# EAGLE board DiscoRap_V11 (EAGLE 6.6.0), part 1 of 2
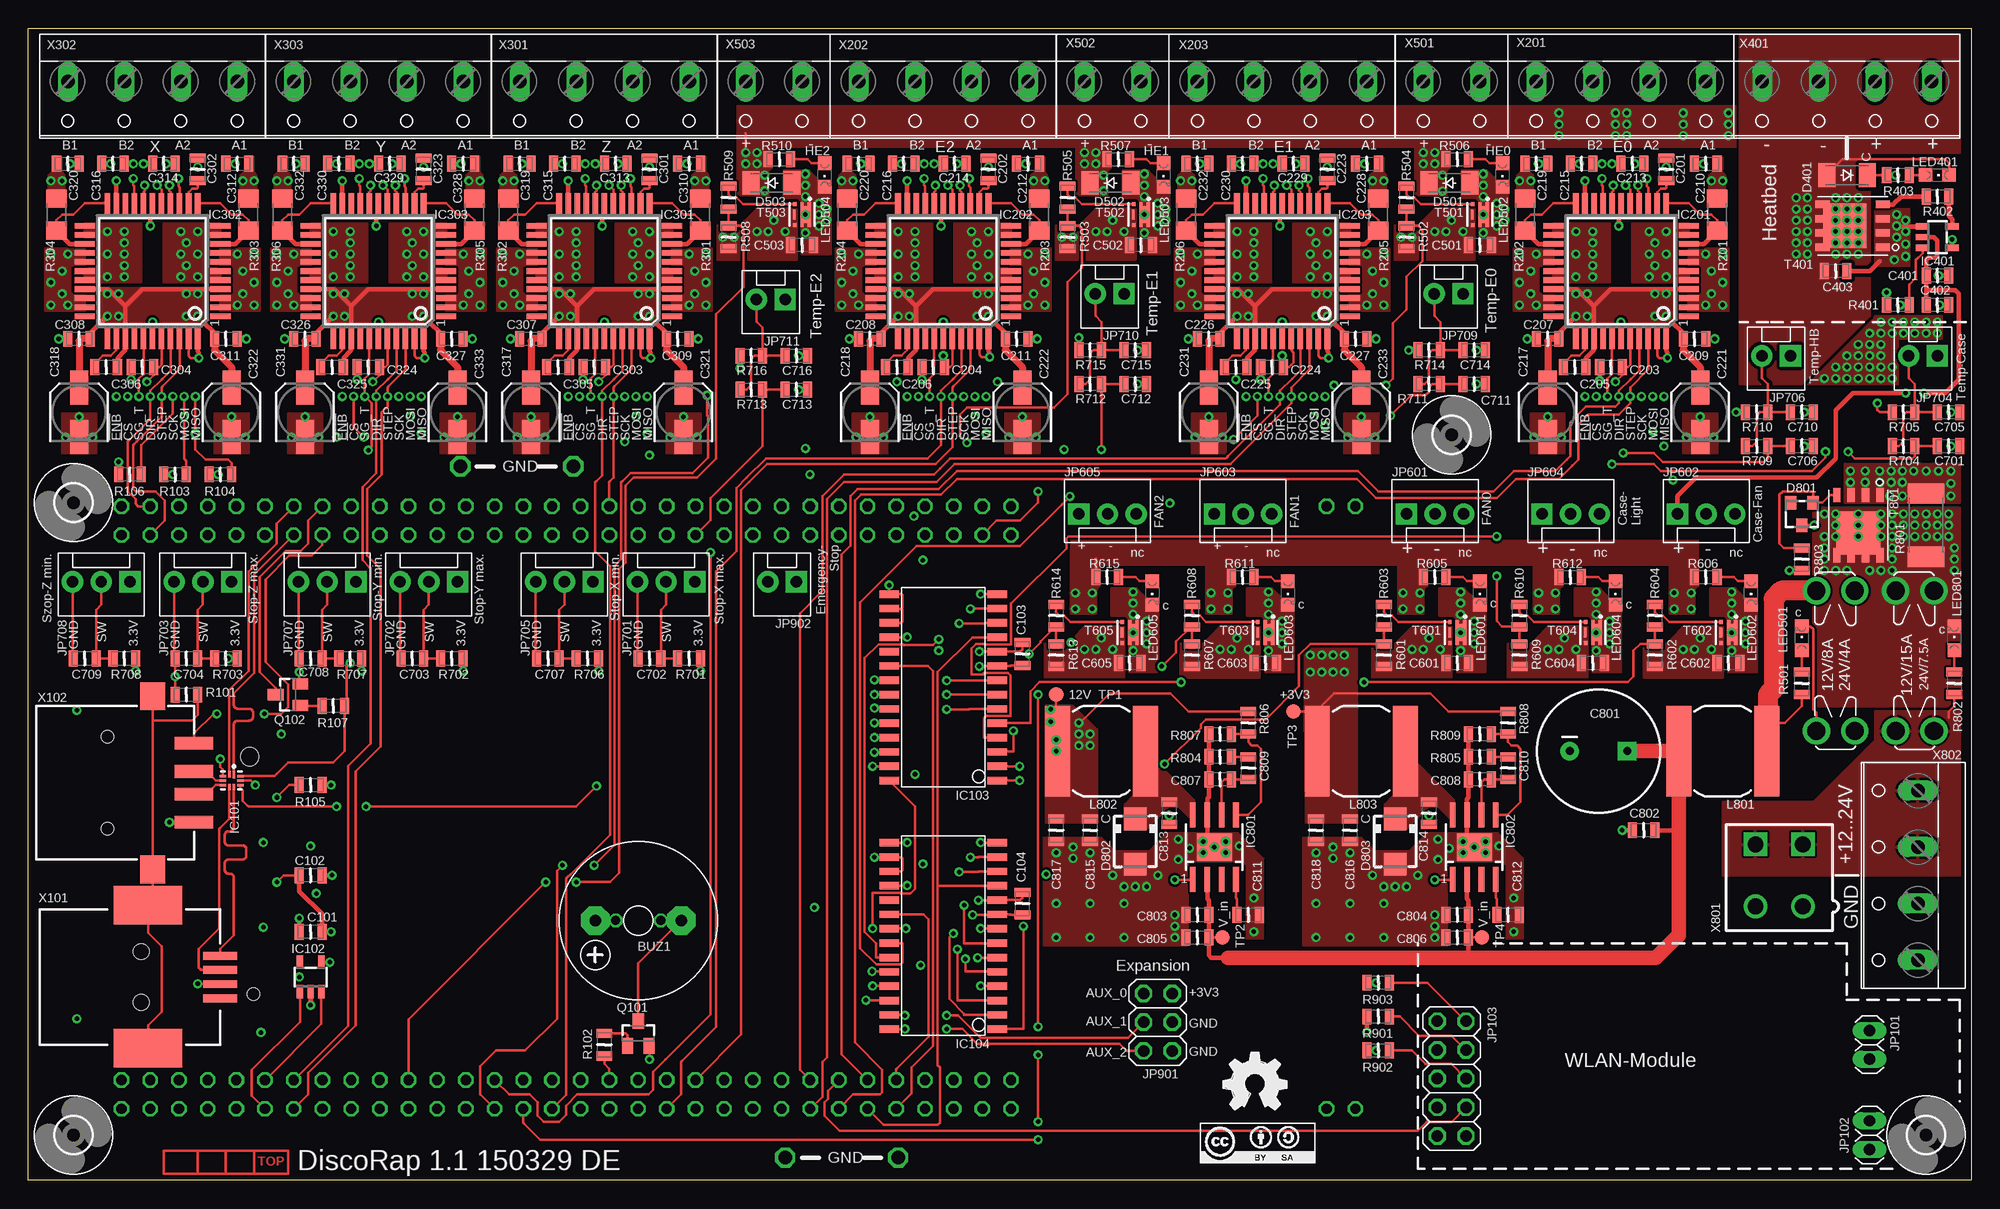
[diagram p9: board, top side]
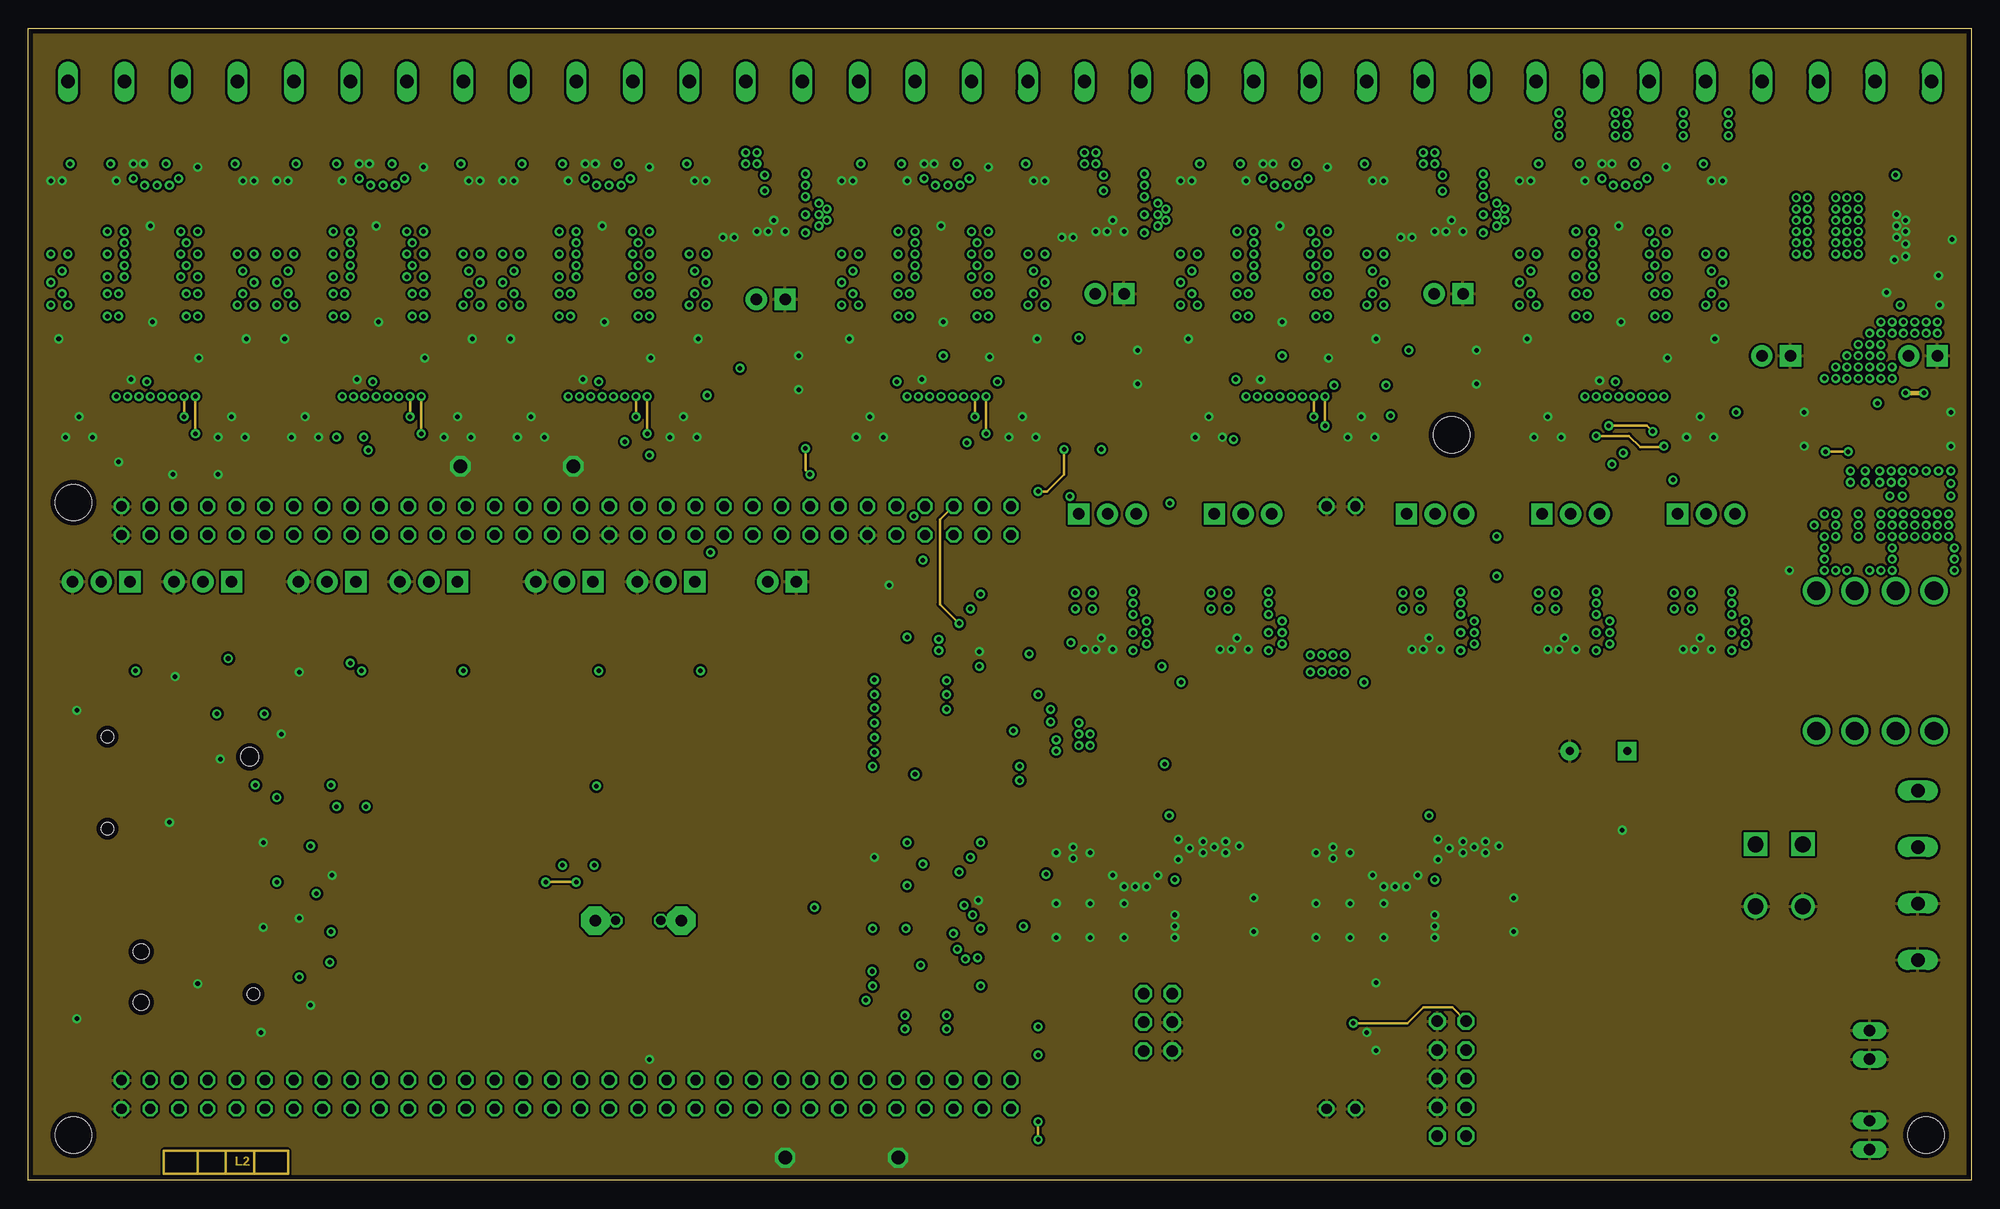
[diagram p10: board, inner layer Route2]
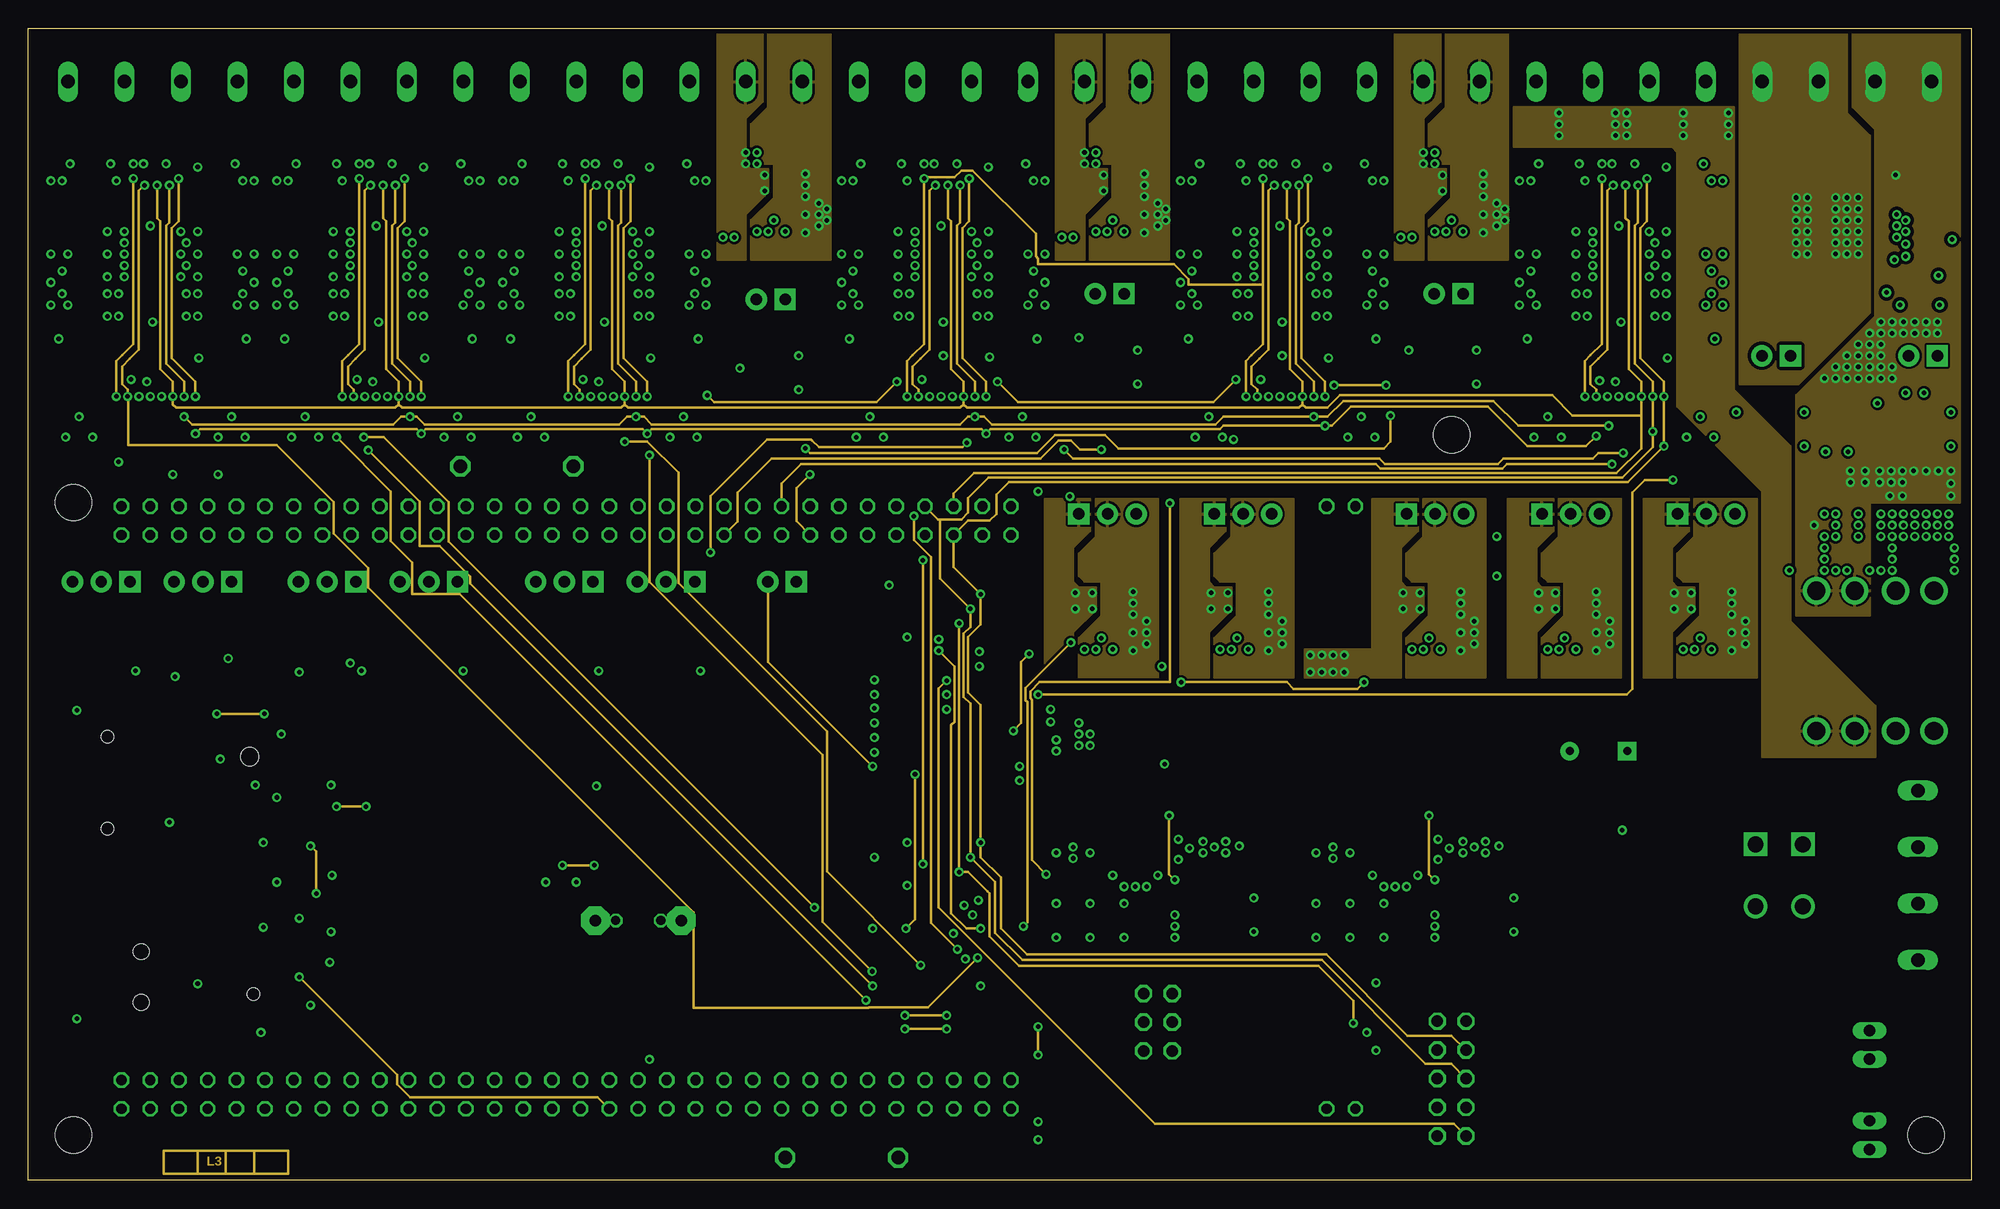
[diagram p11: board, inner layer Route15]
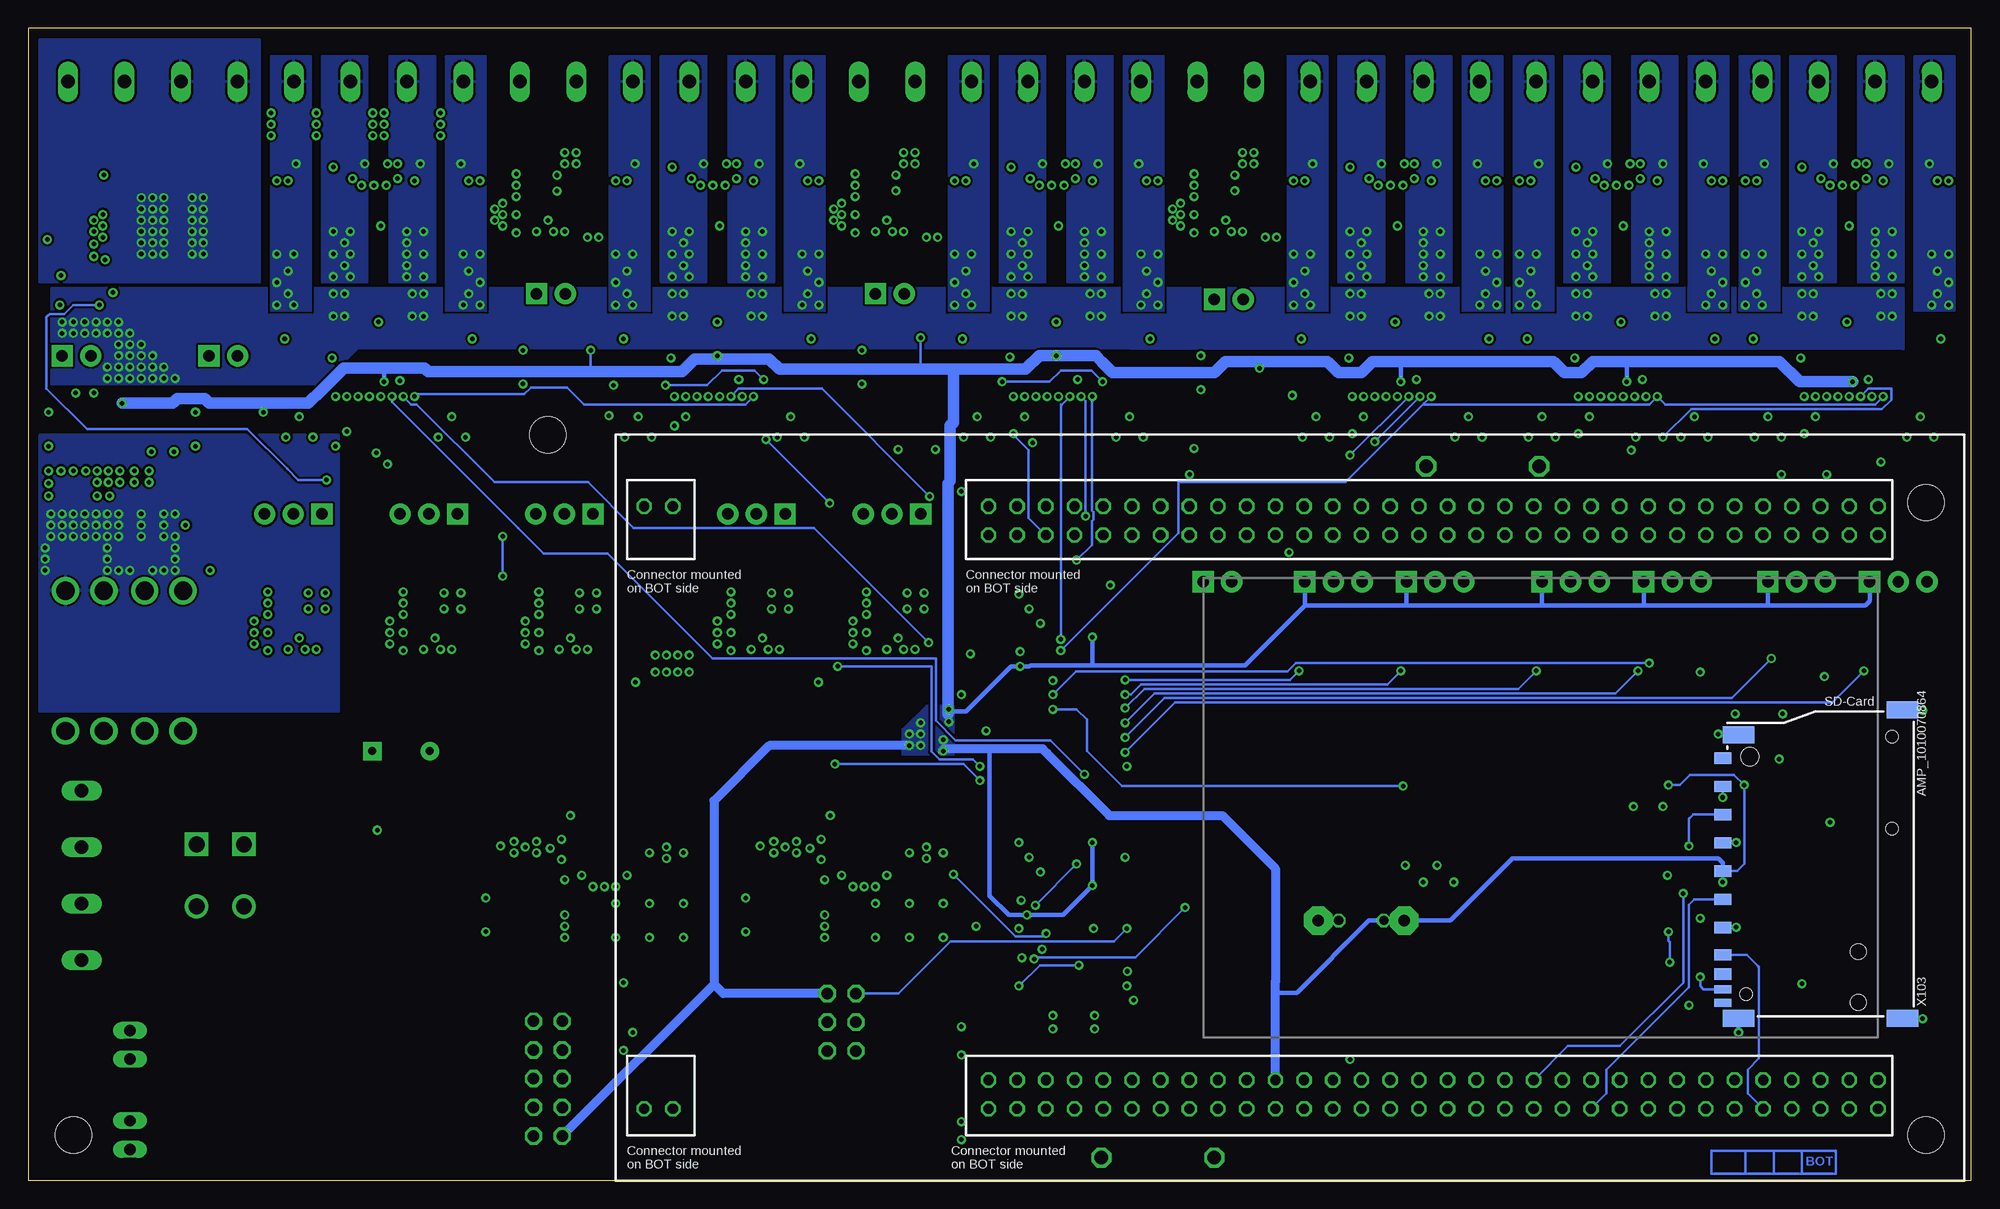
[diagram p12: board, bottom side, seen from below]

Size 172 x 102 mm. Coordinates in mm from the lower left corner, seen from the top.
Outline: 0,0 0,102 172,102 172,0 0,0
Copper layers (1+(2*15)+16): Top 0.035mm / dielectric 0.2mm / Route2 0.035mm / dielectric 1mm / Route15 0.035mm / dielectric 0.2mm / Bottom 0.035mm
Design rules "Multi_PCB_Rules *": minimum track width 0.2mm, minimum drill 0.4mm, track to track 0.2mm, track to pad 0.2mm, pad to pad 0.2mm, via to via 0.2mm, smd to smd 0mil, copper to edge 0.4mm, drill to drill 0.2mm, minimum pad ring 0.2mm, minimum via ring 0.2mm, stop-mask expansion 0mil, vias tented up to drill 0.5mm, thermal gap 0.2mm

## Footprints (pad centres in the part's own frame; a part is rotated, then mirrored left to right if it is on the bottom)
F/CM12P = drill 1.016 pad 2.54 octagon: + 3.81,0; - -3.81,0
0805 = smd 0.8 x 1.4: 1 -1,0; 2 1,0
SANYO-OSCON_SMD_B6 = smd 3 x 1.6: + 2.2,0; - -2.2,0
CPOL-RADIAL-1000UF-25V = drill 0.7 pad 1.651 square: 1 2.54,0 | drill 0.7 pad 1.651: 2 -2.54,0
SOD-123_MINI-SMA = smd 1.5 x 2.1: A 1.8,0; C -1.8,0
TO236 = smd 1 x 1.2: A -1,-1; C 0,1; NC 1,-1
SMA = smd 2 x 2: A 2,0; C -2,0
3557 = drill 1.6: 1 -6.2,1.7; 2 -6.2,-1.7; 3 6.2,-1.7; 4 6.2,1.7
3,2 = hole 3.2: 0,0
MINI_QFN_10L = smd 0.663 x 0.225: 1 -0.52,0.2 | smd 0.563 x 0.225: 2 -0.57,-0.2; 6 0.57,-0.2; 7 0.57,0.2 | smd 0.225 x 0.563: 3 -0.4,-0.77; 4 0,-0.77; 5 0.4,-0.77; 8 0.4,0.77; 9 0,0.77; 10 -0.4,0.77
SOT23-5L = smd 0.55 x 1.2: 1 -0.95,-1.3; 2 0,-1.3; 3 0.95,-1.3; 4 0.95,1.3; 5 -0.95,1.3
SO28W = smd 0.65 x 1.7: 1 -7.62,-4.78; 2 -6.35,-4.78; 3 -5.08,-4.78; 4 -3.81,-4.78; 5 -2.54,-4.78; 6 -1.27,-4.78; 7 0,-4.78; 8 1.27,-4.78; 9 2.54,-4.78; 10 3.81,-4.78; 11 5.08,-4.78; 12 6.35,-4.78; 13 7.62,-4.78; 14 8.89,-4.78; 15 8.89,4.78; 16 7.62,4.78; 17 6.35,4.78; 18 5.08,4.78; 19 3.81,4.78; 20 2.54,4.78; 21 1.27,4.78; 22 0,4.78; 23 -1.27,4.78; 24 -2.54,4.78; 25 -3.81,4.78; 26 -5.08,4.78; 27 -6.35,4.78; 28 -7.62,4.78
SQFP-S-10X10-44 = smd 0.5 x 1.8: 1 -4,-6; 2 -3.2,-6; 3 -2.4,-6; 4 -1.6,-6; 5 -0.8,-6; 6 0,-6; 7 0.8,-6; 8 1.6,-6; 9 2.4,-6; 10 3.2,-6; 11 4,-6; 23 4,6; 24 3.2,6; 25 2.4,6; 26 1.6,6; 27 0.8,6; 28 0,6; 29 -0.8,6; 30 -1.6,6; 31 -2.4,6; 32 -3.2,6; 33 -4,6 | smd 1.8 x 0.5: 12 6,-4; 13 6,-3.2; 14 6,-2.4; 15 6,-1.6; 16 6,-0.8; 17 6,0; 18 6,0.8; 19 6,1.6; 20 6,2.4; 21 6,3.2; 22 6,4; 34 -6,4; 35 -6,3.2; 36 -6,2.4; 37 -6,1.6; 38 -6,0.8; 39 -6,0; 40 -6,-0.8; 41 -6,-1.6; 42 -6,-2.4; 43 -6,-3.2; 44 -6,-4
PDSO-G8 = smd 0.5 x 2.2: 1 -1.905,-2.857; 2 -0.635,-2.857; 3 0.635,-2.857; 4 1.905,-2.857; 5 1.905,2.857; 6 0.635,2.857; 7 -0.635,2.857; 8 -1.905,2.857 | smd 3.1 x 2.4: 9 0,0
1X02 = drill 1.016 long: 1 -1.27,0; 2 1.27,0
2X05 = drill 1.016 octagon: 1 -5.08,-1.27; 2 -5.08,1.27; 3 -2.54,-1.27; 4 -2.54,1.27; 5 0,-1.27; 6 0,1.27; 7 2.54,-1.27; 8 2.54,1.27; 9 5.08,-1.27; 10 5.08,1.27
MOLEX-1X3 = drill 1.016 pad 1.88 square: 1 0,0 | drill 1.016 pad 1.88: 2 2.54,0; 3 5.08,0
MOLEX-1X2 = drill 1.016 pad 1.88 square: 1 0,0 | drill 1.016 pad 1.88: 2 2.54,0
2X03 = drill 1.016 octagon: 1 -2.54,-1.27; 2 -2.54,1.27; 3 0,-1.27; 4 0,1.27; 5 2.54,-1.27; 6 2.54,1.27
SRN8040 = smd 2.2 x 8: 1 -3.9,0; 2 3.9,0
CHIPLED_0805 = smd 1.2 x 1.2: A 0,-1.05; C 0,1.05
SOT23-BEC = smd 1 x 1.4: B -0.95,-1.1; C 0,1.1; E 0.95,-1.1
R1206 = smd 1.6 x 1.803: 1 -1.422,0; 2 1.422,0
R2512 = smd 1.8 x 3.2: 1 -2.8,0; 2 2.8,0
SO-8_POWERPACK = smd 1.27 x 0.66: 1 -2.667,1.905; 2 -2.667,0.635; 3 -2.667,-0.635; 4 -2.667,-1.905; 5 2.667,-1.905; 6 2.667,-0.635; 7 2.667,0.635; 8 2.667,1.905 | smd 3.81 x 3.912: EXP_PAD 0.686,0
SC70-6L = smd 0.3 x 0.35: 1 -0.65,-0.925; 2 0,-0.925; 3 0.65,-0.925; 4 0.65,0.925; 5 0,0.925; 6 -0.65,0.925 | smd 0.95 x 1.5: EXP_DRAIN -0.325,0 | smd 0.235 x 0.87: EXP_SOURCE 0.675,0
B1,27 = smd 1.27 x 1.27: TP 0,0
USB_B_SMD = smd 0.7 x 3: 1 1.875,0; 2 -0.625,0; 3 -1.875,0; 4 0.625,0 | smd 3.4 x 6.04: 5 6.3,-6.4; 6 -6.35,-6.4 | hole 1.4: -2.25,-7; 2.25,-7
TE_USB_A_SMD = smd 1.12 x 3.39: 1 -3.5,7.68; 2 -1,7.68; 3 1,7.68; 4 3.5,7.68 | smd 2.44 x 2.22: 5 -7.67,4; 6 7.67,4 | hole 1.1: -4.06,0; 4.06,0
AMP_1010070864 = smd 1 x 1.5: 1 6.88,0; 2 4.38,0; 3 1.88,0; 4 -0.62,0; 5 -3.12,0; 6 -5.62,0; 7 -8.04,0; 8 -9.74,0; 9 9.38,0 | smd 0.7 x 1.5: DET -11.08,0; WP -12.28,0 | smd 1.5 x 2.8: GND1 -13.65,-1.4; GND2 11.45,-1.4; GND3 -13.65,-15.9; GND4 13.65,-15.9 | hole 1.1: -11.5,-2.05 | hole 1.6: 9.5,-2.4
STM429_DISCOVERY = drill 0.9 octagon: 1 -26.67,30.48; 1A -26.67,0; 1B 24.13,0; 2 26.67,30.48; 2A -24.13,0; 2B 26.67,0; 3 -26.67,27.94; 3A -26.67,-2.54; 3B 24.13,-2.54; 4 26.67,27.94; 4A -24.13,-2.54; 4B 26.67,-2.54; 5A -26.67,-5.08; 5B 24.13,-5.08; 6A -24.13,-5.08; 6B 26.67,-5.08; 7A -26.67,-7.62; 7B 24.13,-7.62; 8A -24.13,-7.62; 8B 26.67,-7.62; 9A -26.67,-10.16; 9B 24.13,-10.16; 10A -24.13,-10.16; 10B 26.67,-10.16; 11A -26.67,-12.7; 11B 24.13,-12.7; 12A -24.13,-12.7; 12B 26.67,-12.7; 13A -26.67,-15.24; 13B 24.13,-15.24; 14A -24.13,-15.24; 14B 26.67,-15.24; 15A -26.67,-17.78; 15B 24.13,-17.78; 16A -24.13,-17.78; 16B 26.67,-17.78; 17A -26.67,-20.32; 17B 24.13,-20.32; 18A -24.13,-20.32; 18B 26.67,-20.32; 19A -26.67,-22.86; 19B 24.13,-22.86; 20A -24.13,-22.86; 20B 26.67,-22.86; 21A -26.67,-25.4; 21B 24.13,-25.4; 22A -24.13,-25.4; 22B 26.67,-25.4; 23A -26.67,-27.94; 23B 24.13,-27.94; 24A -24.13,-27.94; 24B 26.67,-27.94; 25A -26.67,-30.48; 25B 24.13,-30.48; 26A -24.13,-30.48; 26B 26.67,-30.48; 27A -26.67,-33.02; 27B 24.13,-33.02; 28A -24.13,-33.02; 28B 26.67,-33.02; 29A -26.67,-35.56; 29B 24.13,-35.56; 30A -24.13,-35.56; 30B 26.67,-35.56; 31A -26.67,-38.1; 31B 24.13,-38.1; 32A -24.13,-38.1; 32B 26.67,-38.1; 33A -26.67,-40.64; 33B 24.13,-40.64; 34A -24.13,-40.64; 34B 26.67,-40.64; 35A -26.67,-43.18; 35B 24.13,-43.18; 36A -24.13,-43.18; 36B 26.67,-43.18; 37A -26.67,-45.72; 37B 24.13,-45.72; 38A -24.13,-45.72; 38B 26.67,-45.72; 39A -26.67,-48.26; 39B 24.13,-48.26; 40A -24.13,-48.26; 40B 26.67,-48.26; 41A -26.67,-50.8; 41B 24.13,-50.8; 42A -24.13,-50.8; 42B 26.67,-50.8; 43A -26.67,-53.34; 43B 24.13,-53.34; 44A -24.13,-53.34; 44B 26.67,-53.34; 45A -26.67,-55.88; 45B 24.13,-55.88; 46A -24.13,-55.88; 46B 26.67,-55.88; 47A -26.67,-58.42; 47B 24.13,-58.42; 48A -24.13,-58.42; 48B 26.67,-58.42; 49A -26.67,-60.96; 49B 24.13,-60.96; 50A -24.13,-60.96; 50B 26.67,-60.96; 51A -26.67,-63.5; 51B 24.13,-63.5; 52A -24.13,-63.5; 52B 26.67,-63.5; 53A -26.67,-66.04; 53B 24.13,-66.04; 54A -24.13,-66.04; 54B 26.67,-66.04; 55A -26.67,-68.58; 55B 24.13,-68.58; 56A -24.13,-68.58; 56B 26.67,-68.58; 57A -26.67,-71.12; 57B 24.13,-71.12; 58A -24.13,-71.12; 58B 26.67,-71.12; 59A -26.67,-73.66; 59B 24.13,-73.66; 60A -24.13,-73.66; 60B 26.67,-73.66; 61A -26.67,-76.2; 61B 24.13,-76.2; 62A -24.13,-76.2; 62B 26.67,-76.2; 63A -26.67,-78.74; 63B 24.13,-78.74; 64A -24.13,-78.74; 64B 26.67,-78.74
W237-4 = drill 1.194 long: 1 -7.5,-1.27; 2 -2.5,-1.27; 3 2.5,-1.27; 4 7.5,-1.27
W237-102 = drill 1.194 long: 1 -2.5,-1.27; 2 2.5,-1.27
MINIFITJR-4-VERTICAL = drill 1.4: 1 2.1,-2.75; 2 -2.1,-2.75 | drill 1.4 square: 3 2.1,2.75; 4 -2.1,2.75

## Placement (x,y rotation side)
BUZ1  F/CM12P  [F/CM12P]  54,23 180 top
C101  100nF  [0805]  25,22 180 top
C102  100nF  [0805]  25,27 0 top
C103  100nF  [0805]  88,46.6 90 top
C104  100nF  [0805]  88,24.5 90 top
C201  470nF/10V  [0805]  145,89.5 90 top
C202  470nF/10V  [0805]  85,89.5 90 top
C203  100nF/50V  [0805]  140.1,72 180 top
C204  100nF/50V  [0805]  80.1,72 180 top
C205  220nF/16V  [0805]  136.9,72 0 top
C206  220nF/16V  [0805]  76.9,72 0 top
C207  100nF/50V  [0805]  134.5,74.5 180 top
C208  100nF/50V  [0805]  74.5,74.5 180 top
C209  100nF/50V  [0805]  147.5,74.5 0 top
C210  100p/100V  [0805]  148.5,90 0 top
C211  100nF/50V  [0805]  87.5,74.5 0 top
C212  100p/100V  [0805]  88.5,90 0 top
C213  100p/100V  [0805]  142,90 180 top
C214  100p/100V  [0805]  82,90 180 top
C215  100p/100V  [0805]  137.5,90 0 top
C216  100p/100V  [0805]  77.5,90 0 top
C217  22µF/ low ESR  [SANYO-OSCON_SMD_B6]  134.5,68 90 top
C218  22µF/ low ESR  [SANYO-OSCON_SMD_B6]  74.5,68 90 top
C219  100p/100V  [0805]  133.5,90 180 top
C220  100p/100V  [0805]  73.5,90 180 top
C221  22µF/ low ESR  [SANYO-OSCON_SMD_B6]  148,68 90 top
C222  22µF/ low ESR  [SANYO-OSCON_SMD_B6]  88,68 90 top
C223  470nF/10V  [0805]  115,89.5 90 top
C224  100nF/50V  [0805]  110.1,72 180 top
C225  220nF/16V  [0805]  106.9,72 0 top
C226  100nF/50V  [0805]  104.5,74.5 180 top
C227  100nF/50V  [0805]  117.5,74.5 0 top
C228  100p/100V  [0805]  118.5,90 0 top
C229  100p/100V  [0805]  112,90 180 top
C230  100p/100V  [0805]  107.5,90 0 top
C231  22µF/ low ESR  [SANYO-OSCON_SMD_B6]  104.5,68 90 top
C232  100p/100V  [0805]  103.5,90 180 top
C233  22µF/ low ESR  [SANYO-OSCON_SMD_B6]  118,68 90 top
C301  470nF/10V  [0805]  55,89.5 90 top
C302  470nF/10V  [0805]  15,89.5 90 top
C303  100nF/50V  [0805]  50.1,72 180 top
C304  100nF/50V  [0805]  10.1,72 180 top
C305  220nF/16V  [0805]  46.9,72 0 top
C306  220nF/16V  [0805]  6.9,72 0 top
C307  100nF/50V  [0805]  44.5,74.5 180 top
C308  100nF/50V  [0805]  4.5,74.5 180 top
C309  100nF/50V  [0805]  57.5,74.5 0 top
C310  100p/100V  [0805]  58.5,90 0 top
C311  100nF/50V  [0805]  17.5,74.5 0 top
C312  100p/100V  [0805]  18.5,90 0 top
C313  100p/100V  [0805]  52,90 180 top
C314  100p/100V  [0805]  12,90 180 top
C315  100p/100V  [0805]  47.5,90 0 top
C316  100p/100V  [0805]  7.5,90 0 top
C317  22µF/ low ESR  [SANYO-OSCON_SMD_B6]  44.5,68 90 top
C318  22µF/ low ESR  [SANYO-OSCON_SMD_B6]  4.5,68 90 top
C319  100p/100V  [0805]  43.5,90 180 top
C320  100p/100V  [0805]  3.5,90 180 top
C321  22µF/ low ESR  [SANYO-OSCON_SMD_B6]  58,68 90 top
C322  22µF/ low ESR  [SANYO-OSCON_SMD_B6]  18,68 90 top
C323  470nF/10V  [0805]  35,89.5 90 top
C324  100nF/50V  [0805]  30.1,72 180 top
C325  220nF/16V  [0805]  26.9,72 0 top
C326  100nF/50V  [0805]  24.5,74.5 180 top
C327  100nF/50V  [0805]  37.5,74.5 0 top
C328  100p/100V  [0805]  38.5,90 0 top
C329  100p/100V  [0805]  32,90 180 top
C330  100p/100V  [0805]  27.5,90 0 top
C331  22µF/ low ESR  [SANYO-OSCON_SMD_B6]  24.5,68 90 top
C332  100p/100V  [0805]  23.5,90 180 top
C333  22µF/ low ESR  [SANYO-OSCON_SMD_B6]  38,68 90 top
C401  100nF  [0805]  169,80.1 0 top
C402  2u2  [0805]  169,77.5 0 top
C403  4n7  [0805]  160,80.5 0 top
C501  4n7  [0805]  128.5,82.8 180 top
C502  4n7  [0805]  98.5,82.8 180 top
C503  4n7  [0805]  68.5,82.8 180 top
C601  4n7  [0805]  126.5,45.8 180 top
C602  4n7  [0805]  150.5,45.8 180 top
C603  4n7  [0805]  109.5,45.8 180 top
C604  4n7  [0805]  138.5,45.8 180 top
C605  4n7  [0805]  97.5,45.8 180 top
C701  470nF  [0805]  170,65 0 top
C702  4n7  [0805]  55,46.2 180 top
C703  4n7  [0805]  34,46.2 180 top
C704  4n7  [0805]  14,46.2 180 top
C705  470nF  [0805]  170,68 0 top
C706  470nF  [0805]  157,65 0 top
C707  4n7  [0805]  46,46.2 180 top
C708  4n7  [0805]  25,46.2 180 top
C709  4n7  [0805]  5,46.2 180 top
C710  470nF  [0805]  157,68 0 top
C711  470nF  [0805]  128,70.5 0 top
C712  470nF  [0805]  98,70.5 0 top
C713  470nF  [0805]  68,70 0 top
C714  470nF  [0805]  128,73.5 0 top
C715  470nF  [0805]  98,73.5 0 top
C716  470nF  [0805]  68,73 0 top
C801  1000uF  [CPOL-RADIAL-1000UF-25V]  139,38 0 top
C802  2n7  [0805]  143,31 180 top
C803  4µ7 (08053D475MAT2A)  [0805]  103.5,23.5 180 top
C804  4µ7 (08053D475MAT2A)  [0805]  126.5,23.5 180 top
C805  4µ7 (08053D475MAT2A)  [0805]  103.5,21.5 180 top
C806  4µ7 (08053D475MAT2A)  [0805]  126.5,21.5 180 top
C807  330p  [0805]  105.5,35.5 180 top
C808  47p  [0805]  128.5,35.5 180 top
C809  10n  [0805]  108,36.5 90 top
C810  2n7  [0805]  131,36.5 90 top
C811  3n3  [0805]  108,23.5 0 top
C812  22n  [0805]  131,23.5 0 top
C813  100nF  [0805]  101,32.5 90 top
C814  100nF  [0805]  124,32.5 90 top
C815  10µ (08056D106KAT2A)  [0805]  94,31 270 top
C816  4µ7 (08053D475MAT2A)  [0805]  117,31 270 top
C817  10µ (08056D106KAT2A)  [0805]  91,31 270 top
C818  4µ7 (08053D475MAT2A)  [0805]  114,31 270 top
D401  CGRM4001-G  [SOD-123_MINI-SMA]  161,89 180 top
D501  CGRM4001-G  [SOD-123_MINI-SMA]  125.8,88.3 0 top
D502  CGRM4001-G  [SOD-123_MINI-SMA]  95.8,88.3 0 top
D503  CGRM4001-G  [SOD-123_MINI-SMA]  65.8,88.3 0 top
D801  BZX84C15SMD  [TO236]  157,59 180 top
D802  B240A-13-F  [SMA]  98,30 270 top
D803  B240A-13-F  [SMA]  121,30 270 top
F501  FUSE3557  [3557]  160,46 90 top
F801  FUSE3557  [3557]  167,46 90 top
H901  MOUNT-HOLE3.2  [3,2]  168,4 0 top
H902  MOUNT-HOLE3.2  [3,2]  4,60 0 top
H903  MOUNT-HOLE3.2  [3,2]  126,66 0 top
H904  MOUNT-HOLE3.2  [3,2]  4,4 0 top
IC101  DG2722  [MINI_QFN_10L]  18,35.4 270 top
IC102  24LC08BT-I/OT  [SOT23-5L]  25,18 0 top
IC103  MCP23S17SO  [SO28W]  81,43 90 top
IC104  MCP23S17SO  [SO28W]  81,21 90 top
IC201  TMC260  [SQFP-S-10X10-44]  141,80.5 90 top
IC202  TMC260  [SQFP-S-10X10-44]  81,80.5 90 top
IC203  TMC260  [SQFP-S-10X10-44]  111,80.5 90 top
IC301  TMC260  [SQFP-S-10X10-44]  51,80.5 90 top
IC302  TMC260  [SQFP-S-10X10-44]  11,80.5 90 top
IC303  TMC260  [SQFP-S-10X10-44]  31,80.5 90 top
IC401  MCP1402  [SOT23-5L]  169,83.5 270 top
IC801  TPS54332  [PDSO-G8]  105,29.5 0 top
IC802  TPS54332  [PDSO-G8]  128,29.5 0 top
JP101  [1X02]  163,12 270 top
JP102  [1X02]  163,4 270 top
JP103  [2X05]  126,9 270 top
JP601  [MOLEX-1X3]  122,59 0 top
JP602  [MOLEX-1X3]  146,59 0 top
JP603  [MOLEX-1X3]  105,59 0 top
JP604  [MOLEX-1X3]  134,59 0 top
JP605  [MOLEX-1X3]  93,59 0 top
JP701  [MOLEX-1X3]  59,53 180 top
JP702  [MOLEX-1X3]  38,53 180 top
JP703  [MOLEX-1X3]  18,53 180 top
JP704  [MOLEX-1X2]  169,73 180 top
JP705  [MOLEX-1X3]  50,53 180 top
JP706  [MOLEX-1X2]  156,73 180 top
JP707  [MOLEX-1X3]  29,53 180 top
JP708  [MOLEX-1X3]  9,53 180 top
JP709  [MOLEX-1X2]  127,78.5 180 top
JP710  [MOLEX-1X2]  97,78.5 180 top
JP711  [MOLEX-1X2]  67,78 180 top
JP901  [2X03]  100,14 270 top
JP902  [MOLEX-1X2]  68,53 180 top
L801  SRN8040-220M  [SRN8040]  150,38 180 top
L802  SRN8040-220M  [SRN8040]  95,38 180 top
L803  SRN8040-150M  [SRN8040]  118,38 180 top
LED401  [CHIPLED_0805]  169,89 270 top
LED501  [CHIPLED_0805]  157,48 0 top
LED502  [CHIPLED_0805]  130.5,89 180 top
LED503  [CHIPLED_0805]  100.5,89 180 top
LED504  [CHIPLED_0805]  70.5,89 180 top
LED601  [CHIPLED_0805]  128.5,52 180 top
LED602  [CHIPLED_0805]  152.5,52 180 top
LED603  [CHIPLED_0805]  111.5,52 180 top
LED604  [CHIPLED_0805]  140.5,52 180 top
LED605  [CHIPLED_0805]  99.5,52 180 top
LED801  [CHIPLED_0805]  170.5,48 0 top
LOGO1  OSHW_LOGO_FILLX0200-NT  [OSHW_FILLX200_NOTEXT]  105.75,6.25 0 top
Q101  BC817-25LT1SMD  [SOT23-BEC]  54,13 0 top
Q102  BC817-25LT1SMD  [SOT23-BEC]  23,43 90 top
R101  10k  [0805]  14,43 180 top
R102  10k  [0805]  51,12 270 top
R103  10k  [0805]  13,62.5 0 top
R104  10k  [0805]  17,62.5 0 top
R105  10k  [0805]  25,35 0 top
R106  10k  [0805]  9,62.5 0 top
R107  10k  [0805]  27,42 0 top
R201  0R15/0.5W  [R1206]  149.5,85.5 90 top
R202  0R15/0.5W  [R1206]  132.5,85.5 90 top
R203  0R15/0.5W  [R1206]  89.5,85.5 90 top
R204  0R15/0.5W  [R1206]  72.5,85.5 90 top
R205  0R15/0.5W  [R1206]  119.5,85.5 90 top
R206  0R15/0.5W  [R1206]  102.5,85.5 90 top
R301  0R15/0.5W  [R1206]  59.5,85.5 90 top
R302  0R15/0.5W  [R1206]  42.5,85.5 90 top
R303  0R15/0.5W  [R1206]  19.5,85.5 90 top
R304  0R15/0.5W  [R1206]  2.5,85.5 90 top
R305  0R15/0.5W  [R1206]  39.5,85.5 90 top
R306  0R15/0.5W  [R1206]  22.5,85.5 90 top
R401  100k  [0805]  165.5,77.5 180 top
R402  100  [0805]  169,87.1 180 top
R403  2k7  [0805]  165.5,89 0 top
R501  2k7  [0805]  157,44 90 top
R502  100k  [0805]  122,83.5 270 top
R503  100k  [0805]  92,83.5 270 top
R504  100  [0805]  122,87 90 top
R505  100  [0805]  92,87 90 top
R506  2k7  [0805]  126.5,90.4 0 top
R507  2k7  [0805]  96.5,90.4 0 top
R508  100k  [0805]  62,83.5 270 top
R509  100  [0805]  62,87 90 top
R510  2k7  [0805]  66.5,90.4 0 top
R601  100k  [0805]  120,46.5 270 top
R602  100k  [0805]  144,46.5 270 top
R603  100  [0805]  120,50 90 top
R604  100  [0805]  144,50 90 top
R605  2k7  [0805]  124.5,53.4 0 top
R606  2k7  [0805]  148.5,53.4 0 top
R607  100k  [0805]  103,46.5 270 top
R608  100  [0805]  103,50 90 top
R609  100k  [0805]  132,46.5 270 top
R610  100  [0805]  132,50 90 top
R611  2k7  [0805]  107.5,53.4 0 top
R612  2k7  [0805]  136.5,53.4 0 top
R613  100k  [0805]  91,46.5 270 top
R614  100  [0805]  91,50 90 top
R615  2k7  [0805]  95.5,53.4 0 top
R701  4k7  [0805]  58.5,46.2 180 top
R702  4k7  [0805]  37.5,46.2 180 top
R703  4k7  [0805]  17.5,46.2 180 top
R704  6k8  [0805]  166,65 180 top
R705  2k2  [0805]  166,68 180 top
R706  4k7  [0805]  49.5,46.2 180 top
R707  4k7  [0805]  28.5,46.2 180 top
R708  4k7  [0805]  8.5,46.2 180 top
R709  6k8  [0805]  153,65 180 top
R710  2k2  [0805]  153,68 180 top
R711  6k8  [0805]  124,70.5 180 top
R712  6k8  [0805]  94,70.5 180 top
R713  6k8  [0805]  64,70 180 top
R714  2k2  [0805]  124,73.5 180 top
R715  2k2  [0805]  94,73.5 180 top
R716  2k2  [0805]  64,73 180 top
R801  0R (n.c.)  [R2512]  168,58 90 top
R802  2k7  [0805]  170.5,44 90 top
R803  82k  [0805]  157,55 90 top
R804  4k87  [0805]  105.5,37.5 0 top
R805  20k  [0805]  128.5,37.5 0 top
R806  10k2 1%  [0805]  108,40.5 90 top
R807  3k24 1%  [0805]  105.5,39.5 0 top
R808  10k2 1%  [0805]  131,40.5 90 top
R809  820 1%  [0805]  128.5,39.5 0 top
R901  3k3  [0805]  119.5,14.5 0 top
R902  3k3  [0805]  119.5,11.5 0 top
R903  3k3  [0805]  119.5,17.5 0 top
T401  SIR416DP  [SO-8_POWERPACK]  161.5,84.5 180 top
T501  SIA400EDJ  [SC70-6L]  128.5,85.5 180 top
T502  SIA400EDJ  [SC70-6L]  98.5,85.5 180 top
T503  SIA400EDJ  [SC70-6L]  68.5,85.5 180 top
T601  SIA400EDJ  [SC70-6L]  126.5,48.5 180 top
T602  SIA400EDJ  [SC70-6L]  150.5,48.5 180 top
T603  SIA400EDJ  [SC70-6L]  109.5,48.5 180 top
T604  SIA400EDJ  [SC70-6L]  138.5,48.5 180 top
T605  SIA400EDJ  [SC70-6L]  97.5,48.5 180 top
T801  SI7145DP  [SO-8_POWERPACK]  162,58 270 top
TP1  TPB1,27  [B1,27]  91,43 270 top
TP2  TPB1,27  [B1,27]  105.7,21.5 90 top
TP3  TPB1,27  [B1,27]  112,41.5 270 top
TP4  TPB1,27  [B1,27]  128.7,21.5 90 top
U$3  CC-BY-SA  [CC-BY-SA]  109,3.75 0 top
X101  USB-B_SMD  [USB_B_SMD]  17,18 270 top
X102  TE_292303-9  [TE_USB_A_SMD]  7,35.2 270 top
X103  AMP_1010070864  [AMP_1010070864]  22,28 90 bottom
X104  STM32F429_DISCO  [STM429_DISCOVERY]  87,33 90 bottom
X201  [W237-4]  141,96 180 top
X202  [W237-4]  81,96 180 top
X203  [W237-4]  111,96 180 top
X301  [W237-4]  51,96 180 top
X302  [W237-4]  11,96 180 top
X303  [W237-4]  31,96 180 top
X401  [W237-4]  161,96 180 top
X501  [W237-102]  126,96 180 top
X502  [W237-102]  96,96 180 top
X503  [W237-102]  66,96 180 top
X801  ATX-4VERTICAL  [MINIFITJR-4-VERTICAL]  155,27 0 top
X802  [W237-4]  166,27 90 top

## Tracks (layer width: path | path; a pad name or v marks a point on that pad's centre or on a via)
!CS_PORTEX
  Top 0.2: IC103.11 83.58,48.08 80.5,45 80.5,43.5 80.5,26 | 80.5,26 80.5,10.2 80.7,10 80.7,5.1 80.5,4.9 75.73,4.9 X104.11A | IC104.11 80.58,26.08 80.5,26
!ENB_EXTRUDERS  (via drill 0.4)
  Top 0.2: IC201.19 139.4,88 139.3,88.1 v139.3,88.7 | IC203.19 109.4,88 109.3,88.1 v109.3,88.7 | IC202.19 79.4,88 79.3,88.1 v79.3,88.7 | v82.85,24.35 82.85,21 85.75,21 IC104.7
  Route15 0.2: v139.3,88.7 139.3,74.05 138.3,73.05 137.8,72.55 v137.8,69.4 | v109.3,88.7 109.3,79.3 | 109.3,79.3 109.3,74.05 108.3,73.05 107.8,72.55 v107.8,69.4 | v77.8,69.4 77.8,72.55 78.3,73.05 79.3,74.05 v79.3,88.7 79.35,88.75 79.35,88.8 82,88.8 82.6,89.4 83.6,89.4 89.2,83.8 89.2,81.8 89.4,81.6 89.4,81.1 101.4,81.1 102.7,79.8 102.7,79.3 109.25,79.3 109.3,79.3 | v79.2,54.9 v79.2,28
  Bottom 0.2: v107.8,69.4 108.5,68.7 122.8,68.7 124.3,70.2 127.5,70.2 128.1,69.6 137.6,69.6 v137.8,69.4 | v79.2,28 v82.85,24.35 | v79.2,54.9 77.85,56.25 77.85,58.35 77.7,58.5 77.7,59.15 77.85,59.3 77.85,69.4 v77.8,69.4
!SPI_EN_E0  (via drill 0.4)
  Top 0.2: IC201.18 140.2,87.5 140.3,87.6 v140.3,88.1 | v88.1,22.5 88.1,13.4 85.8,13.4 IC104.1
  Route15 0.2: v140.3,88.1 139.8,87.6 139.8,82.3 139.8,79.7 139.8,74.5 139.8,73.55 139,72.75 138.3,72.05 138.3,70.5 138.8,70 v138.8,69.4 | v88.1,22.5 88.45,22.85 88.45,42.35 88.3,42.5 88.3,43.6 v92.3,47.6
  Bottom 0.2: v92.3,47.6 102.45,57.75 118.4,57.75 122.45,61.8 130.7,61.8 137.6,68.7 138.1,68.7 v138.8,69.4
!SPI_EN_E1  (via drill 0.4)
  Top 0.2: IC203.18 110.2,87.5 110.3,87.6 v110.3,88.1 | v81.9,21.85 81.55,21.5 81.55,16.05 82.85,14.75 82.85,14.65 85.75,14.65 IC104.2 | v106.7,65.6 108.8,67.7 v108.8,69.4
  Route15 0.2: v110.3,88.1 109.8,87.6 109.8,82.3 109.8,79.7 109.8,74.5 109.8,73.55 109,72.75 108.3,72.05 108.3,70.5 108.8,70 v108.8,69.4 | v90.1,27.1 88.85,28.35 88.85,42.55 88.7,42.7 88.7,43.3 89.5,44.1 101.05,44.1 v101.05,59.95
  Bottom 0.2: v81.9,21.85 82.15,21.6 84.6,21.6 v90.1,27.1 | v106.7,65.6 v101.05,59.95
!SPI_EN_E2  (via drill 0.4)
  Top 0.2: IC202.18 80.2,87.5 80.3,87.6 v80.3,88.1 | v82.25,20.45 82.25,15.95 85.75,15.95 IC104.3
  Route15 0.2: v80.3,88.1 79.8,87.6 79.8,82.3 79.8,79.7 79.8,74.5 79.8,73.55 79,72.75 78.3,72.05 78.3,70.5 78.8,70 v78.8,69.4 | v82.25,20.45 79.9,22.8 79.9,55.2 78.4,56.7 v78.4,58.8
  Bottom 0.2: v78.4,58.8 78.4,69 v78.8,69.4
!SPI_EN_X  (via drill 0.4)
  Top 0.2: IC301.18 50.2,87.5 50.3,87.6 v50.3,88.1 | v84.3,17.2 85.75,17.2 IC104.4
  Route15 0.2: v50.3,88.1 49.8,87.6 49.8,82.3 49.8,79.7 49.8,74.5 49.8,73.55 49,72.75 48.3,72.05 48.3,70.5 48.8,70 v48.8,69.4 | v79,19.05 70.7,27.35 70.7,39.75 57.55,52.9 57.55,62.65 54.8,65.4 v52.8,65.4
  Bottom 0.2: v84.3,17.2 82.45,19.05 v79,19.05 | v48.8,69.4 v52.8,65.4
!SPI_EN_Y  (via drill 0.4)
  Top 0.2: IC303.18 30.2,87.5 30.3,87.6 v30.3,88.1 | v82.95,19.6 82.95,18.5 85.75,18.5 85.75,18.49 IC104.5 | v29.7,65.8 28.8,66.7 v28.8,69.4
  Route15 0.2: v30.3,88.1 29.8,87.6 29.8,82.3 29.8,79.7 29.8,74.5 29.8,73.55 29,72.75 28.3,72.05 28.3,70.5 28.8,70 v28.8,69.4 | v69.6,24.15 37.2,56.55 37.2,60.05 31.45,65.8 v29.7,65.8
  Bottom 0.2: v82.95,19.6 82.8,19.75 74,19.75 v69.6,24.15
!SPI_EN_Z  (via drill 0.4)
  Top 0.2: IC302.18 10.2,87.5 10.3,87.6 v10.3,88.1 | v84.05,19.7 85.75,19.7 IC104.6
  Route15 0.2: v10.3,88.1 9.8,87.6 9.8,82.3 9.8,79.7 9.8,74.5 9.8,73.55 9,72.75 8.3,72.05 8.3,70.5 8.8,70 v8.8,69.4 8.85,69.35 8.85,65.1 22,65.1 27.05,60.05 27.05,57.25 30.1,54.2 30.1,52.5 58.9,23.7 58.9,15.25 74.4,15.25 74.45,15.3 79.65,15.3 v84.05,19.7
!USB_OE  (via drill 0.4)
  Top 0.2: IC101.8 18.77,34.73 19,34.5 19,34.2 19,33.6 19.4,33.2 19.5,33.1 v27.3,33.1 | v29.9,33.1 48.5,33.1 v50.3,34.9 | IC103.6 83.33,41.73 83.3,41.7 v81.3,41.7
  Route15 0.2: v27.3,33.1 v29.9,33.1
  Bottom 0.2: v50.3,34.9 75.2,34.9 78.3,38 78.3,40.8 79.2,41.7 v81.3,41.7
!X_Y_Z_EN  (via drill 0.4)
  Top 0.2: IC301.19 49.4,88 49.3,88.1 v49.3,88.7 | IC303.19 29.4,88 29.3,88.1 v29.3,88.7 | IC302.19 9.4,88 9.3,88.1 v9.3,88.7 | v84.3,22.3 85.75,22.3 IC104.8
  Route15 0.2: v49.3,88.7 49.3,74.05 48.3,73.05 47.8,72.55 v47.8,69.4 | v29.3,88.7 29.3,74.05 28.3,73.05 27.8,72.55 v27.8,69.4 | v9.3,88.7 9.3,74.05 8.3,73.05 7.8,72.55 v7.8,69.4 | v84.3,22.3 83.05,22.3 81.7,23.65 81.7,40.3 82,40.6 82,42.7 82,45.5 v80.6,46.9
  Bottom 0.2: v7.8,69.4 8.5,68.7 27.1,68.7 v27.8,69.4 27.85,69.35 28.5,68.7 48.4,68.7 48.45,68.75 | v80.6,46.9 70.2,57.3 70.2,61.8 55.4,61.8 48.45,68.75 | v47.8,69.4 48.45,68.75
+3V3  (via drill 0.4, 0.8)
  Top 0.2: TP1.TP 91,38.1 L802.2 | R806.2 102.7,41.5 101.1,43.1 95.7,43.1 93,40.4 | IC201.40 141.8,72.2 141.6,72 C203.1 141.1,71.3 v140.5,70.7 | IC202.40 81.8,72.2 81.6,72 C204.1 81.1,73 v81,73 | IC301.40 51.8,72.2 51.6,72 C303.1 51.1,71.3 v50.5,70.7 | IC303.40 31.8,72.2 31.6,72 C324.1 31.1,71.3 v30.5,70.7 | IC302.40 11.8,72.2 11.6,72 C304.1 11.1,71.3 v10.5,70.7 | IC103.18 77.58,48.08 77.6,48.1 v77.8,48.1 | C103.1 87,45.6 86.94,45.54 IC103.9 84.44,45.54 84.24,45.54 v84.2,45.5 | C104.1 87,23.5 86.96,23.54 IC104.9 85.74,23.5 v83.6,23.5 | R710.2 v151.2,68 | R705.2 163.9,68 163.7,68.2 v163.7,68.8 | R716.2 v63,71.9 | R715.2 93,74.1 v93,74.6 | v122.2,73.5 R714.2 | IC101.9 19.7,35.4 v20.1,35 | C102.1 22.6,27 v22,26.4 | C101.1 v26.8,22 | v26.7,19.3 IC102.4 | IC104.15 v77.79,29.89 v77.8,29.9 | IC104.18 77.78,26.08 v77.8,26.1 | v26.8,35 R105.2 | IC203.40 111.8,73.5 112,73.3 112,72.7 112,72.4 111.8,72.2 111.6,72 C224.1 111.1,72.7 111,72.7 v111,73
  Top 0.406: C102.1 24,25.6 26,23.6 C101.1
  Bottom 0.2: v151.2,68 151.2,68.7 151.1,68.8 | v63,71.9 63,72.3 63.2,72.5 | v93,74.6 93,71.8 | v122.2,73.5 122.2,71.9 121.9,71.6 | v22,26.4 X103.4 21.98,27.4 20.7,27.4 20.1,28 v20.1,35 21,35.9 24.9,35.9 25.8,35 | 25.8,35 v26.8,35 25.8,35 | v26.7,19.3 26.7,21.1 26.8,21.2 v26.8,22 | 110.6,72.7 110.8,72.7 | 80.6,73 v81,73 | v111,73 111,72.7
  Bottom 0.406: JP708.1 9,51.3 9.4,50.9 17.9,50.9 | 17.9,50.9 29,50.9 | 29,50.9 37.9,50.9 | 37.9,50.9 49.9,50.9 | 49.9,50.9 59,50.9 | 59,50.9 64.3,45.6 77.7,45.6 | 77.7,45.6 83,45.6 83.3,45.6 83.4,45.5 v84.2,45.5 85,45.5 88,42.5 89,41.5 90.6,41.5 | v77.8,48.1 77.8,45.7 77.7,45.6 | JP701.1 59,50.9 | JP705.1 50,51 49.9,50.9 | JP702.1 38,51 37.9,50.9 | JP707.1 29,50.9 | JP703.1 18,51 17.9,50.9 | v30.5,70.7 30.5,72.1 30.9,72.5 | v50.5,70.7 50.5,72.1 50.1,72.5 | 80.5,72.9 80.6,73 | 110.5,72.6 110.6,72.7 | v140.5,70.7 140.5,71.5 140.9,71.9 | 61.6,16.6 59.7,16.6 53.3,23 v52,23 BUZ1.+ 46.1,23 40.6,28.5 22.4,28.5 22,28.1 X103.4 | 86.9,38.2 86.9,26.2 86.9,25.2 85.2,23.5 v83.6,23.5 80.4,23.5 v77.8,26.1 v77.8,29.9
  Bottom 0.813: X104.22A 61.6,16.6 61.6,17.5 | 61.6,17.5 61.6,17.6 | L802.2 90.9,38.2 86.9,38.2 82.2,38.2 81.8,37.8 76.3,32.3 66.3,32.3 61.6,27.6 61.6,17.5 | v94,38.5 106.4,38.5 111.3,33.6 111.3,17.35 | 111.3,17.35 JP103.9 | JP901.2 110.49,16.54 111.3,17.35
  Bottom 1: 83.7,71.8 86.8,71.8 | 121.9,71.6 136.6,71.6 | 136.9,71.9 140.9,71.9
  Bottom 1.016: v10.5,70.7 15.2,70.7 17,72.5 30.9,72.5 33.5,72.5 34.5,71.5 36,71.5 37,72.5 50.1,72.5 53,72.5 54,71.5 56,71.5 57,72.5 63.2,72.5 66,72.5 67,71.5 76,71.5 77,72.5 77.5,73 80.6,73 82.5,73 83.7,71.8 | 86.8,71.8 90.1,71.8 | 90.1,71.8 93,71.8 105.5,71.8 106.4,72.7 110.6,72.7 110.8,72.7 111,72.7 113,72.7 114.1,71.6 116.2,71.6 121.9,71.6 | 136.6,71.6 136.9,71.9 | 140.9,71.9 144.1,71.9 146,70 147.2,68.8 151.1,68.8 151.8,68.8 156,68.8 156.4,69.2 158.8,69.2 159.2,68.8 v163.7,68.8 | 90.1,71.8 90.1,67.1 90.3,66.9 90.4,66.8 90.4,61.9 90.5,61.8 90.6,61.7 90.6,41.5 90.6,41.3
  other vias: 93,40.5 93,39.5 93,38.5 94,39.5 91,38 91,39 90.5,41.7 90.5,40.6
  pour Top (no thermals): 94.6,31.7 94.6,39.9 92.5,42 90.1,42 90.1,31.7
  pour Bottom (rank 3): 90.1,42 90.1,37.7 94.6,37.7 94.6,39.9 92.5,42
+12V  (via drill 0.4)
  Top 0.2: L803.2 114,38.1 114,41.5 | R808.2 125.7,41.5 124.1,43.1 118.7,43.1 115.6,43.1 114,41.5 | R615.1 94.5,55 | 114,41.5 TP3.TP
  Top 0.406: C402.1 168,78.8 | 168,78.8 C401.1 168,81.5 168.2,81.7 168.8,81.7 169,81.9 169,83.2 168.7,83.5 IC401.2 | 168,78.8 170.6,78.8 170.9,78.5 170.9,70.9 169.7,69.7 v167.8,69.7 | v166.2,69.7 161.5,69.7 160,68.2 160,63.9 158.3,62.2 147.6,62.2 146,60.6 JP602.1
  Route2 0.406: v166.2,69.7 v167.8,69.7
  other vias: 123.2,50.6 123.2,52 106.2,50.6 106.2,52 94.2,50.6 94.2,52 147.2,50.6 147.2,52 135.2,50.6 135.2,52 92.7,52 92.7,50.6 104.7,52 104.7,50.6 121.7,52 121.7,50.6 133.7,52 133.7,50.6 145.7,52 145.7,50.6 113.5,45 114.5,45 115.5,45 116.5,45 115.5,46.5 116.5,46.5 113.5,46.5 114.5,46.5
  pour Route15: 123,60.3 119,60.3 119,44.5 121.5,44.5 121.5,48.5 123.5,50.5 123.5,52.5 122,52.5 121.5,53 121.5,56 123,57.5
  pour Top (no thermals): 123.5,50.2 123.5,52.3 123.8,52.6 123.8,55.6 121.3,55.6 121.3,50.2
  pour Route15: 106,60.3 102,60.3 102,44.5 104.5,44.5 104.5,48.5 106.5,50.5 106.5,52.5 105,52.5 104.5,53 104.5,56 106,57.5
  pour Top (no thermals): 106.5,50.2 106.5,52.3 106.8,52.6 106.8,55.6 104.3,55.6 104.3,50.2
  pour Route15: 94,60.3 90,60.3 90,44.5 92.5,44.5 92.5,48.5 94.5,50.5 94.5,52.5 93,52.5 92.5,53 92.5,56 94,57.5
  pour Top (no thermals): 94.5,50.2 94.5,52.3 94.8,52.6 94.8,55.6 92.3,55.6 92.3,50.2
  pour Route15: 147,60.3 143,60.3 143,44.5 145.5,44.5 145.5,48.5 147.5,50.5 147.5,52.5 146,52.5 145.5,53 145.5,56 147,57.5
  pour Top (no thermals): 147.5,50.2 147.5,52.3 147.8,52.6 147.8,55.6 145.3,55.6 145.3,50.2
  pour Route15: 135,60.3 131,60.3 131,44.5 133.5,44.5 133.5,48.5 135.5,50.5 135.5,52.5 134,52.5 133.5,53 133.5,56 135,57.5
  pour Top (no thermals): 135.5,50.2 135.5,52.3 135.8,52.6 135.8,55.6 133.3,55.6 133.3,50.2
  pour Top (no thermals): 117.6,31.7 117.6,42.3 113,42.3 113.1,31.7
  pour Top (rank 3): 92.3,56.6 147.8,56.6 147.8,54.5 92.3,54.5
  pour Top (rank 3): 113,39.5 113,56.6 117.6,56.6 117.6,39.5
  pour Route15: 113,44.5 121.5,44.5 121.5,47 113,47
+24V
  Top 0.2: TP2.TP C805.1 | TP4.TP C806.1
  Top 0.406: IC801.2 104.36,24.93 104.5,24.8 C803.1 C805.1 104.5,20 104.5,19.9 104.7,19.7 106.2,19.7 | IC802.2 127.36,24.93 127.5,24.8 C804.1 C806.1 127.5,19.8 127.4,19.7 | C802.1 146.1,31
  Top 1.27: 106.2,19.7 127.4,19.7 144.1,19.7 145.8,21.4 146.1,21.7 146.1,31 L801.2 C801.1
+UB  (via drill 0.4)
  Top 0.2: D401.C R403.1 v165.3,89 | D801.C v158.1,58 | R501.1 157,42 155.5,40.5 154,40.5
  Top 0.4: C205.2 137.9,72.8 138.5,73.4 138.6,73.5 IC201.36 | C225.2 107.9,72.8 108.5,73.4 108.6,73.5 IC203.36 | C206.2 77.9,72.8 78.5,73.4 78.6,73.5 IC202.36 | C305.2 47.9,72.8 48.5,73.4 48.6,73.5 IC301.36 | C325.2 27.9,72.8 28.5,73.4 28.6,73.5 IC303.36 | C306.2 7.9,72.8 8.5,73.4 8.6,73.5 IC302.36
  Top 0.406: IC201.36 138.6,77.4 | 138.6,77.4 138.5,77.5 137.1,78.9 IC201.30 | IC201.4 140.1,78.9 138.6,77.4 | 135.5,74.7 C207.1 135.5,74.7 | 135.5,74.7 135.5,75 v137,76.5 | C209.1 146.5,75 145.5,76 | IC203.36 108.6,77.4 | 108.6,77.4 108.5,77.5 107.1,78.9 IC203.30 | IC203.4 110.1,78.9 108.6,77.4 | 105.5,74.7 C226.1 105.5,74.7 | 105.5,74.7 105.5,75 v107,76.5 | C227.1 116.5,75 115.5,76 | IC202.36 78.6,77.4 | 78.6,77.4 78.5,77.5 77.1,78.9 IC202.30 | IC202.4 80.1,78.9 78.6,77.4 | 75.5,74.7 C208.1 75.5,74.7 | 75.5,74.7 75.5,75 v77,76.5 | C211.1 86.5,75 85.5,76 | IC301.36 48.6,77.4 | 48.6,77.4 48.5,77.5 47.1,78.9 IC301.30 | IC301.4 50.1,78.9 48.6,77.4 | 45.5,74.7 C307.1 45.5,74.7 | 45.5,74.7 45.5,75 v47,76.5 | C309.1 56.5,75 55.5,76 | IC303.36 28.6,77.4 | 28.6,77.4 28.5,77.5 27.1,78.9 IC303.30 | IC303.4 30.1,78.9 28.6,77.4 | 25.5,74.7 C326.1 25.5,74.7 | 25.5,74.7 25.5,75 v27,76.5 | C327.1 36.5,75 35.5,76 | IC302.36 8.6,77.4 | 8.6,77.4 8.5,77.5 7.1,78.9 IC302.30 | IC302.4 10.1,78.9 8.6,77.4 | 5.5,74.7 C308.1 5.5,74.7 | 5.5,74.7 5.5,75 v7,76.5 | C311.1 16.5,75 15.5,76
  Top 0.61: C207.1 134.7,74.5 134.5,74.3 C217.+ | C209.1 146.5,73.5 148,72 C221.+ | C226.1 104.7,74.5 104.5,74.3 C231.+ | C227.1 116.5,73.5 118,72 C233.+ | C208.1 74.7,74.5 74.5,74.3 C218.+ | C211.1 86.5,73.5 88,72 C222.+ | C307.1 44.7,74.5 44.5,74.3 C317.+ | C309.1 56.5,73.5 58,72 C321.+ | C326.1 24.7,74.5 24.5,74.3 C331.+ | C327.1 36.5,73.5 38,72 C333.+ | C308.1 4.7,74.5 4.5,74.3 C318.+ | C311.1 16.5,73.5 18,72 C322.+
  Top 1.778: F501.4 155.2,52.2 154.5,51.5 154.5,43.5 154,43 154,40.5
  Top 1.93: 154,40.5 154,38.1 L801.1
  other vias: 161.3,61.8 162.6,61.8 163.9,61.8 164.8,60.6 165.9,60.6 165.9,61.8 165.9,62.8 166.9,62.8 168,62.8 169.1,62.8 170.2,62.8 170.2,61.7 170.2,60.6 161.3,62.8 162.6,62.8 163.9,62.8 164.9,62.8 164.9,61.8 7,78.5 8,78.5 8,76.5 15,78.5 15,76.5 14,78.5 14,76.5 27,78.5 28,78.5 28,76.5 35,78.5 35,76.5 34,76.5 34,78.5 47,78.5 48,78.5 48,76.5 55,78.5 55,76.5 54,78.5 54,76.5 77,78.5 78,78.5 78,76.5 85,78.5 85,76.5 84,78.5 84,76.5 107,78.5 108,78.5 108,76.5 115,78.5 115,76.5 114,76.5 114,78.5 137,78.5 138,78.5 138,76.5 144,78.5 144,76.5 145,78.5 145,76.5 159,71 160,71 161,71 162,71 163,71 164,71 165,71 165,72 164,72 163,72 162,72 161,72 160,72 161,73 162,73 163,73 164,73 162,74 163,74 164,74 163,75 164,75 165,75 166,75 167,75 168,75 169,75 164,76 165,76 166,76 167,76 168,76 169,76
  pour Top (no thermals): 136.5,79 145.5,79 145.5,76 136.5,76
  pour Top (no thermals): 106.5,79 115.5,79 115.5,76 106.5,76
  pour Top (no thermals): 76.5,79 85.5,79 85.5,76 76.5,76
  pour Top (no thermals): 46.5,79 55.5,79 55.5,76 46.5,76
  pour Top (no thermals): 26.5,79 35.5,79 35.5,76 26.5,76
  pour Top (no thermals): 6.5,79 15.5,79 15.5,76 6.5,76
  pour Route15 (isolate 0.3, no thermals): 161.5,101.5 161.5,95 163.5,93 163.5,76.5 171,76.5 171,101.5
  pour Route15: 171,60 163,60 163,50 156.5,50 156.5,69.5 163.5,76.5 171,76.5
  pour Top (no thermals): 160.8,60 160.8,63.4 171,63.4 171,60
  pour Bottom (rank 3, no thermals): 169.9,79 6,79 6,73.6 142.8,73.7 146,70.5 169.9,70.5
  pour Top (rank 3, no thermals): 169.4,76.5 169.4,74.5 165.5,74.5 165.5,70.5 157.5,70.5 163.5,76.5
AUX_IN_0  (via drill 0.4)
  Top 0.2: v74.75,22.3 74.75,25.45 77.2,25.45 77.25,25.4 78.1,25.4 78.5,25.8 78.5,33.1 76.25,35.35 IC103.28
  Bottom 0.2: v74.75,22.3 75.9,21.15 90.35,21.15 94.95,16.55 98.7,16.55 JP901.1
AUX_IN_1  (via drill 0.4)
  Top 0.2: IC104.27 77.55,14.65 v77.6,14.6 | JP901.3 97.33,12.6 84.3,12.6 84.2,12.7 82.3,14.6 v81.3,14.6
  Route15 0.2: v77.6,14.6 v81.3,14.6
AUX_IN_2  (via drill 0.4)
  Top 0.2: IC104.28 77.58,13.38 v77.6,13.4 | v81.3,13.4 82.7,13.4 84,12.1 96.6,12.1 97.2,11.5 97.24,11.46 JP901.5
  Route15 0.2: v77.6,13.4 v81.3,13.4
BUZZER
  Top 0.2: X104.30A 51.44,9.86 51,10.3 R102.2
CASE_FAN_EN  (via drill 0.4)
  Top 0.2: v102.05,44.1 89.5,44.1 88.7,43.3 88.7,40.5 85.8,40.5 85.8,40.48 IC103.5 | v118.25,44.1 140.4,44.1 141.6,44.1 142.1,44.6 142.1,46.9 142.7,47.5 R602.1 R604.1 143.95,49.05
  Route15 0.2: v118.25,44.1 117.65,43.5 112,43.5 111.4,44.1 v102.05,44.1
CASE_LIGHT_EN  (via drill 0.4)
  Top 0.2: R609.1 R610.1 131.95,49.05 130.45,49.05 130,49.5 v130,53.5 | v130,57 92.1,57 91.9,56.8 91.9,55.95 87,51.05 87,47.45 84.8,47.45 84.75,47.5 83.9,47.5 83.5,47.1 83.5,44.8 84.5,44.8 84.6,44.9 86.75,44.9 86.95,44.7 86.95,41.1 84.8,41.1 84.6,40.9 84.6,39.2 85.75,39.2 85.76,39.19 IC103.4
  Bottom 0.2: v130,57 v130,53.5
CASE_TEMP  (via drill 0.4)
  Top 0.2: C701.1 R704.1 167,64.1 166.8,63.9 161.7,63.9 v161.1,64.5 | v159.1,64.5 159.1,64 157.9,62.8 144.5,62.8 143.9,63.4 v140.2,63.4
  Route2 0.2: v161.1,64.5 v159.1,64.5
  Route15 0.2: v140.2,63.4 130.9,63.4 130.5,63 119.7,63 119.3,63.4 68.4,63.4 66.68,61.68 X104.18B
E0_A1  (via drill 0.4)
  Top 0.4: C210.1 v148.3,90
  other vias: 148.5,77.5 150,77.5 148.5,82 150,82 150,79.5 149,78.5 149,80.5
  pour Top (no thermals): 147,82.5 147,81 148,81 148,78.5 147,78.5 147,77 150.5,77 150.5,82.5
  pour Bottom: 150.5,77 147,77 147,99.5 150.5,99.5
E0_A2  (via drill 0.4)
  Top 0.4: C213.1 v142.2,90
  other vias: 145,80 144,81 144,83 145,84 143.5,84 143.5,80 143.5,82 145,82
  pour Top (rank 2, no thermals): 142,79.5 147,79.5 147,80.7 145.8,80.7 145.8,83.5 147,83.5 147,84.7 142,84.7
  pour Bottom: 142,79.5 146,79.5 146,99.5 142,99.5
E0_A3  (via drill 0.4)
  Top 0.4: C229.1 v112.2,90
  other vias: 115,80 114,81 114,83 115,84 113.5,84 113.5,80 113.5,82 115,82
  pour Top (rank 2, no thermals): 112,79.5 117,79.5 117,80.7 115.8,80.7 115.8,83.5 117,83.5 117,84.7 112,84.7
  pour Bottom: 112,79.5 116,79.5 116,99.5 112,99.5
E0_A4  (via drill 0.4)
  Top 0.4: C228.1 v118.3,90
  other vias: 118.5,77.5 120,77.5 118.5,82 120,82 120,79.5 119,78.5 119,80.5
  pour Top (no thermals): 117,82.5 117,81 118,81 118,78.5 117,78.5 117,77 120.5,77 120.5,82.5
  pour Bottom: 120.5,77 117,77 117,99.5 120.5,99.5
E0_A5  (via drill 0.4)
  Top 0.4: C214.1 v82.2,90
  other vias: 85,80 84,81 84,83 85,84 83.5,84 83.5,80 83.5,82 85,82
  pour Top (rank 2, no thermals): 82,79.5 87,79.5 87,80.7 85.8,80.7 85.8,83.5 87,83.5 87,84.7 82,84.7
  pour Bottom: 82,79.5 86,79.5 86,99.5 82,99.5
E0_A6  (via drill 0.4)
  Top 0.4: C212.1 v88.3,90
  other vias: 88.5,77.5 90,77.5 88.5,82 90,82 90,79.5 89,78.5 89,80.5
  pour Top (no thermals): 87,82.5 87,81 88,81 88,78.5 87,78.5 87,77 90.5,77 90.5,82.5
  pour Bottom: 90.5,77 87,77 87,99.5 90.5,99.5
E0_A7  (via drill 0.4)
  Top 0.4: C313.1 v52.2,90
  other vias: 55,80 54,81 54,83 55,84 53.5,84 53.5,80 53.5,82 55,82
  pour Top (rank 2, no thermals): 52,79.5 57,79.5 57,80.7 55.8,80.7 55.8,83.5 57,83.5 57,84.7 52,84.7
  pour Bottom: 52,79.5 56,79.5 56,99.5 52,99.5
E0_A8  (via drill 0.4)
  Top 0.4: C310.1 v58.3,90
  other vias: 58.5,77.5 60,77.5 58.5,82 60,82 60,79.5 59,78.5 59,80.5
  pour Top (no thermals): 57,82.5 57,81 58,81 58,78.5 57,78.5 57,77 60.5,77 60.5,82.5
  pour Bottom: 60.5,77 57,77 57,99.5 60.5,99.5
E0_A9  (via drill 0.4)
  Top 0.4: C329.1 v32.2,90
  other vias: 35,80 34,81 34,83 35,84 33.5,84 33.5,80 33.5,82 35,82
  pour Top (rank 2, no thermals): 32,79.5 37,79.5 37,80.7 35.8,80.7 35.8,83.5 37,83.5 37,84.7 32,84.7
  pour Bottom: 32,79.5 36,79.5 36,99.5 32,99.5
E0_A10  (via drill 0.4)
  Top 0.4: C328.1 v38.3,90
  other vias: 38.5,77.5 40,77.5 38.5,82 40,82 40,79.5 39,78.5 39,80.5
  pour Top (no thermals): 37,82.5 37,81 38,81 38,78.5 37,78.5 37,77 40.5,77 40.5,82.5
  pour Bottom: 40.5,77 37,77 37,99.5 40.5,99.5
E0_A11  (via drill 0.4)
  Top 0.4: C314.1 v12.2,90
  other vias: 15,80 14,81 14,83 15,84 13.5,84 13.5,80 13.5,82 15,82
  pour Top (rank 2, no thermals): 12,79.5 17,79.5 17,80.7 15.8,80.7 15.8,83.5 17,83.5 17,84.7 12,84.7
  pour Bottom: 12,79.5 16,79.5 16,99.5 12,99.5
E0_A12  (via drill 0.4)
  Top 0.4: C312.1 v18.3,90
  other vias: 18.5,77.5 20,77.5 18.5,82 20,82 20,79.5 19,78.5 19,80.5
  pour Top (no thermals): 17,82.5 17,81 18,81 18,78.5 17,78.5 17,77 20.5,77 20.5,82.5
  pour Bottom: 20.5,77 17,77 17,99.5 20.5,99.5
E0_B1  (via drill 0.4)
  Top 0.4: v133.7,90 C219.1
  other vias: 132,77.5 133,78.5 132,79.5 132,82 133,80.5 133.5,82 133.5,77.5
  pour Top (no thermals): 135,82.5 135,81 133.7,81 133.7,78.5 135,78.5 135,77 131.5,77 131.5,82.5
  pour Bottom: 135,77 135,99.5 131.5,99.5 131.5,77
E0_B2  (via drill 0.4)
  Top 0.4: C215.1 v137.3,90
  other vias: 138.5,83 137,84 138.5,81 137,80 138.5,84 138.5,80 137,82 138.5,82
  pour Top (rank 2, no thermals): 135,79.5 140,79.5 140,84.7 135,84.7 135,83.5 136.2,83.5 136.2,80.7 135,80.7
  pour Bottom: 140,79.5 140,99.5 136,99.5 136,79.5
E0_B3  (via drill 0.4)
  Top 0.4: v103.7,90 C232.1
  other vias: 102,77.5 103,78.5 102,79.5 102,82 103,80.5 103.5,82 103.5,77.5
  pour Top (no thermals): 105,82.5 105,81 103.7,81 103.7,78.5 105,78.5 105,77 101.5,77 101.5,82.5
  pour Bottom: 105,77 105,99.5 101.5,99.5 101.5,77
E0_B4  (via drill 0.4)
  Top 0.4: C230.1 v107.3,90
  other vias: 108.5,83 107,84 108.5,81 107,80 108.5,84 108.5,80 107,82 108.5,82
  pour Top (rank 2, no thermals): 105,79.5 110,79.5 110,84.7 105,84.7 105,83.5 106.2,83.5 106.2,80.7 105,80.7
  pour Bottom: 110,79.5 110,99.5 106,99.5 106,79.5
E0_B5  (via drill 0.4)
  Top 0.4: v73.7,90 C220.1
  other vias: 72,77.5 73,78.5 72,79.5 72,82 73,80.5 73.5,82 73.5,77.5
  pour Top (no thermals): 75,82.5 75,81 73.7,81 73.7,78.5 75,78.5 75,77 71.5,77 71.5,82.5
  pour Bottom: 75,77 75,99.5 71.5,99.5 71.5,77
E0_B6  (via drill 0.4)
  Top 0.4: C216.1 v77.3,90
  other vias: 78.5,83 77,84 78.5,81 77,80 78.5,84 78.5,80 77,82 78.5,82
  pour Top (rank 2, no thermals): 75,79.5 80,79.5 80,84.7 75,84.7 75,83.5 76.2,83.5 76.2,80.7 75,80.7
  pour Bottom: 80,79.5 80,99.5 76,99.5 76,79.5
E0_B7  (via drill 0.4)
  Top 0.4: v43.7,90 C319.1
  other vias: 42,77.5 43,78.5 42,79.5 42,82 43,80.5 43.5,82 43.5,77.5
  pour Top (no thermals): 45,82.5 45,81 43.7,81 43.7,78.5 45,78.5 45,77 41.5,77 41.5,82.5
  pour Bottom: 45,77 45,99.5 41.5,99.5 41.5,77
E0_B8  (via drill 0.4)
  Top 0.4: C315.1 v47.3,90
  other vias: 48.5,83 47,84 48.5,81 47,80 48.5,84 48.5,80 47,82 48.5,82
  pour Top (rank 2, no thermals): 45,79.5 50,79.5 50,84.7 45,84.7 45,83.5 46.2,83.5 46.2,80.7 45,80.7
  pour Bottom: 50,79.5 50,99.5 46,99.5 46,79.5
E0_B9  (via drill 0.4)
  Top 0.4: v23.7,90 C332.1
  other vias: 22,77.5 23,78.5 22,79.5 22,82 23,80.5 23.5,82 23.5,77.5
  pour Top (no thermals): 25,82.5 25,81 23.7,81 23.7,78.5 25,78.5 25,77 21.5,77 21.5,82.5
  pour Bottom: 25,77 25,99.5 21.5,99.5 21.5,77
E0_B10  (via drill 0.4)
  Top 0.4: C330.1 v27.3,90
  other vias: 28.5,83 27,84 28.5,81 27,80 28.5,84 28.5,80 27,82 28.5,82
  pour Top (rank 2, no thermals): 25,79.5 30,79.5 30,84.7 25,84.7 25,83.5 26.2,83.5 26.2,80.7 25,80.7
  pour Bottom: 30,79.5 30,99.5 26,99.5 26,79.5
E0_B11  (via drill 0.4)
  Top 0.4: v3.7,90 C320.1
  other vias: 2,77.5 3,78.5 2,79.5 2,82 3,80.5 3.5,82 3.5,77.5
  pour Top (no thermals): 5,82.5 5,81 3.7,81 3.7,78.5 5,78.5 5,77 1.5,77 1.5,82.5
  pour Bottom: 5,77 5,99.5 1.5,99.5 1.5,77
E0_B12  (via drill 0.4)
  Top 0.4: C316.1 v7.3,90
  other vias: 8.5,83 7,84 8.5,81 7,80 8.5,84 8.5,80 7,82 8.5,82
  pour Top (rank 2, no thermals): 5,79.5 10,79.5 10,84.7 5,84.7 5,83.5 6.2,83.5 6.2,80.7 5,80.7
  pour Bottom: 10,79.5 10,99.5 6,99.5 6,79.5
E0_DIR  (via drill 0.4)
  Top 0.2: IC201.41 142.6,71.7 141.9,71 141.8,70.9 140.8,69.9 v140.8,69.4 140.8,68.8 140.5,68.5 137.9,68.5 136.5,67.1 136.5,64.1 136.2,63.8 135.2,62.8 131.5,62.8 129.7,61 119.5,61 117.7,62.8 106.7,62.8 82.2,62.8 80.6,61.2 77,61.2 73.4,61.2 72.8,60.6 72.8,59 72.8,56.2 72,55.4 72,11.17 X104.12A
E0_SG_TST  (via drill 0.4)
  Top 0.2: IC201.38 140.2,71.4 139.8,71 v139.8,69.4 | v77.7,22.3 76.25,22.3 IC104.21
  Route15 0.2: v77.7,22.3 78.5,23.1 v78.5,35.95
  Bottom 0.2: v78.5,35.95 81.5,38.95 89.9,38.95 91.65,40.7 91.65,46.2 111.4,46.2 120.7,55.5 125,55.5 126.4,55.5 128.65,57.75 139.8,68.9 v139.8,69.4
E0_STP  (via drill 0.4)
  Top 0.2: IC201.42 143.4,71.8 141.8,70.2 v141.8,69.4 141.8,68.8 140.8,67.8 138.1,67.8 137.2,66.9 137.2,63.8 136.7,63.3 135.5,62.1 131.7,62.1 130,60.4 119.3,60.4 117.6,62.1 107.2,62.1 82.2,62.1 80.8,60.7 73.7,60.7 73.2,60.2 73.2,12.2 75.6,9.8 75.6,7.8 75.4,7.6 73.03,7.6 X104.13A
E1_DIR  (via drill 0.4)
  Top 0.2: IC203.41 112.6,71.7 111.9,71 110.8,69.9 v110.8,69.4 110.8,68.7 106.2,64.1 106.1,64 106,63.9 81.6,63.9 80.7,63 80.2,62.5 72.2,62.5 70.3,60.6 70.3,59.2 70.3,52.2 68.3,50.2 68.3,9.79 X104.16A
E1_SG_TST  (via drill 0.4)
  Top 0.2: IC203.38 110.2,71.4 109.8,71 v109.8,69.4 | v92.2,60.55 91.5,59.85 87.8,56.15 87.3,56.15 78.65,56.15 73.65,51.15 73.65,20.55 75.1,19.1 77.2,19.1 77.4,19.3 77.4,21 76.25,21 IC104.22
  Bottom 0.2: v92.2,60.55 101.75,70.1 109.1,70.1 v109.8,69.4
E1_STP  (via drill 0.4)
  Top 0.2: IC203.42 113.4,71.8 111.8,70.2 v111.8,69.4 111.8,68.8 106.4,63.4 82,63.4 80.4,61.8 72.2,61.8 70.7,60.3 70.7,10.9 70.3,10.5 70.3,7.41 X104.15A
E2_DIR  (via drill 0.4)
  Top 0.2: IC202.41 82.6,71.7 81.9,71 81.8,70.9 80.8,69.9 v80.8,69.4 80.8,65.1 79.6,63.9 75.1,63.9 65.3,63.9 63.6,62.2 62.7,61.3 62.7,56.1 62.7,55.7 60.9,53.9 60.9,13.6 57.9,10.6 57.8,10.5 57.8,7.61 X104.25A
E2_SG_TST  (via drill 0.4)
  Top 0.2: IC202.38 80.2,71.4 79.8,71 v79.8,69.4 | v80.6,47.9 80.1,47.4 77.5,47.4 77.45,47.45 75.25,47.45 74.05,46.25 74.05,22 75.05,21 75.05,19.75 76.2,19.75 IC104.23
  Bottom 0.2: v80.6,47.9 80.6,68.7 80.5,68.7 v79.8,69.4
E2_STP  (via drill 0.4)
  Top 0.2: IC202.42 83.4,71.8 81.9,70.3 81.8,70.2 v81.8,69.4 81.8,64.9 80.3,63.4 66.7,63.4 65.4,63.4 63.8,61.8 63.1,61.1 63.1,56.1 63.1,12.91 X104.24A
EMERGENCY_STOP  (via drill 0.4)
  Top 0.2: v74.75,36.65 76.2,36.65 IC103.27
  Route15 0.2: v74.75,36.65 65.5,45.9 65.5,53 JP902.2
FAN0_EN  (via drill 0.4)
  Top 0.2: R603.1 120,48 R601.1 113.5,47.5 112.5,46.5 112.5,43.75 109.55,40.8 104.25,40.8 103.8,40.35 103.8,40.05 v100.6,36.85 | v87.75,35.4 85.8,35.4 IC103.1
  Bottom 0.2: v87.75,35.4 89.2,36.85 v100.6,36.85
FAN1_EN  (via drill 0.4)
  Top 0.2: R607.1 R608.1 102.95,49.05 101.6,47.7 101.6,46.75 v100.35,45.5 | v87.75,36.65 85.8,36.65 IC103.2
  Bottom 0.2: v87.75,36.65 88.35,37.25 91.35,37.25 92.05,37.95 92.05,45.5 v100.35,45.5
FAN2_EN  (via drill 0.4)
  Top 0.2: R613.1 R614.1 90.95,49.05 89.6,47.7 89.6,47.6 v88.6,46.6 | v87.2,39.8 87.2,37.95 85.8,37.95 85.8,37.94 IC103.3
  Route15 0.2: v87.2,39.8 87.9,40.5 87.9,45.9 v88.6,46.6
GND  (via drill 0.4, 1.2)
  Top 0.2: IC201.43 144.2,73 144.3,72.9 144.4,72.8 v145.1,72.8 | IC203.43 114.2,73 114.3,72.9 114.4,72.8 v115.1,72.8 | IC202.43 84.2,73.1 84.4,72.9 v85.1,72.9 | IC301.43 54.2,73 54.3,72.9 54.4,72.8 v55.1,72.8 | IC303.43 34.2,73 34.3,72.9 34.4,72.8 v35.1,72.8 | IC302.43 14.2,73 14.3,72.9 14.4,72.8 v15.1,72.8 | JP701.3 53.92,46.28 C702.2 | JP702.3 32.92,46.28 C703.2 | JP703.3 12.92,46.28 C704.2 v13,44.6 R101.2 | JP708.3 3.92,46.28 C709.2 | JP707.3 23.92,46.28 C708.2 v24,45 24,44.05 Q102.E | JP705.3 44.92,46.28 C707.2 | IC101.3 17.23,36.37 17,36.6 v17,37.3 | v76.2,52.7 76.22,52.68 IC103.15 77.31,51.89 77.4,51.8 77.4,50.7 77.3,50.6 | 77.3,50.6 76.24,50.6 IC103.16 | 77.3,50.6 77.4,50.5 77.4,49.5 77.3,49.4 77.25,49.35 IC103.17 | v74.9,28.6 76.2,28.6 | 76.2,28.6 IC104.16 | 76.2,28.6 77.3,28.6 77.4,28.5 77.4,27.5 77.3,27.4 77.25,27.35 IC104.17 | v84.1,24.8 IC104.10 87.81,24.81 88,25 C104.2 | v84.2,46.8 85.7,46.8 | 85.7,46.8 IC103.10 | 85.7,46.8 87.8,46.8 88,47 C103.2 | X101.4 15.03,17.38 v15,17.4 | v55,10.7 55,11.85 Q101.E
  Top 0.4: IC201.39 v141,76 | IC201.44 145,73.4 145.1,73.3 v145.1,72.8 | C201.2 v145,89.7 | IC201.21 v137.8,88.5 | C215.2 v139.3,90 | C213.2 v140.2,90 | C207.2 v132.7,74.5 | C209.2 v149.3,74.5 | C203.2 v139.1,70.8 | IC201.17 141,85.3 140.8,85.1 v140.8,84.5 | IC203.39 v111,76 | IC203.44 115,73.4 115.1,73.3 v115.1,72.8 | C223.2 v115,89.7 | IC203.21 v107.8,88.5 | C230.2 v109.3,90 | C229.2 v110.2,90 | C226.2 v102.7,74.5 | C227.2 v119.3,74.5 | C224.2 v109.1,70.9 | IC203.17 111,85.3 110.8,85.1 v110.8,84.5 | IC202.39 v81,76 | IC202.44 85,73.4 85.1,73.3 v85.1,72.9 | C202.2 v85,89.7 | IC202.21 v77.8,88.5 | C216.2 v79.3,90 | C214.2 v80.2,90 | C208.2 v72.7,74.5 | C211.2 v89.3,74.5 | C204.2 v79.1,70.9 | IC202.17 81,85.3 80.8,85.1 v80.8,84.5 | IC301.39 v51,76 | IC301.44 55,73.4 55.1,73.3 v55.1,72.8 | C301.2 v55,89.7 | IC301.21 v47.8,88.5 | C315.2 v49.3,90 | C313.2 v50.2,90 | C307.2 v42.7,74.5 | C309.2 v59.3,74.5 | C303.2 v49.1,70.9 | IC301.17 51,85.3 50.8,85.1 v50.8,84.5 | IC303.39 v31,76 | IC303.44 35,73.4 35.1,73.3 v35.1,72.8 | C323.2 v35,89.7 | IC303.21 v27.8,88.5 | C330.2 v29.3,90 | C329.2 v30.2,90 | C326.2 v22.7,74.5 | C327.2 v39.3,74.5 | C324.2 v29.1,70.9 | IC303.17 31,85.3 30.8,85.1 v30.8,84.5 | IC302.39 v11,76 | IC302.44 15,73.4 15.1,73.3 v15.1,72.8 | C302.2 v15,89.7 | IC302.21 v7.8,88.5 | C316.2 v9.3,90 | C314.2 v10.2,90 | C308.2 v2.7,74.5 | C311.2 v19.3,74.5 | C304.2 v9.1,70.9 | IC302.17 11,85.3 10.8,85.1 v10.8,84.5
  Top 0.406: R807.1 R804.1 C807.2 104.5,33.9 104.4,33.8 104.36,33.77 IC801.7 104.36,30.14 IC801.9 | R809.1 R805.1 C808.2 127.5,33.9 127.4,33.8 127.36,33.77 IC802.7 127.36,30.14 IC802.9 | IC401.1 165.55,84.45 | IC401.4 v170.3,83.3 | v169.2,77.5 C402.2 | v169.1,80.1 C401.2 | R401.2 v164.5,78.6 | C403.2 163,80.5 163.9,81.4 | C706.2 v157.2,65 | C710.2 v157.2,68 | C711.2 v128.2,70.5 | C714.2 v128.2,73.5 | C712.2 v98.2,70.5 | C715.2 v98.2,73.5 | C713.2 v68.2,70 | C716.2 v68.2,73 | C701.2 v170.2,65 | C705.2 v170.2,68 | R106.1 v8,63.6 | R103.1 v12.8,62.5 | R104.1 v16.8,62.5 | v119.3,17.5 R903.1 | v119.3,11.5 R902.1 | v118.5,13.1 R901.1 | v12.5,31.7 X102.4 | v24,23.2 C101.2 | C102.2 v26.9,27 | IC102.2 v25,15.5 | v141.1,31 C802.2 | R803.1 v155.9,54
  Bottom 0.406: v4.3,41.6 6.05,41.6 X103.GND4 | X103.GND2 20.65,39.5 v22.4,39.5 | v20.8,29.9 21.98,29.9 X103.3 | v20.8,22.4 21.98,22.4 X103.6 | X103.GND1 v20.6,13.1 | v4.3,14.3 6.05,14.3 X103.GND3
  other vias: 104,29 104,30 106,30 106,29 105,29.5 108.5,25 108.5,22 101.8,28.4 101.8,30.2 107.2,29.6 102.8,29.4 91,21.5 92.5,29.5 91,29 94,29 97,26 98,26 99,26 100,27 96,27 101.5,22.5 101.5,21.5 101.5,23.5 91,24.5 94,21.5 94,24.5 97,24.5 97,21.5 92.5,28.5 127,29 127,30 129,30 129,29 128,29.5 131.5,25 131.5,22 124.8,28.4 124.8,30.2 130.2,29.6 125.8,29.4 114,21.5 115.5,29.5 114,29 117,29 120,26 121,26 122,26 123,27 119,27 124.5,22.5 124.5,21.5 124.5,23.5 114,24.5 117,21.5 117,24.5 120,24.5 120,21.5 115.5,28.5 132,88.5 133,88.5 150,88.5 149,88.5 134.5,67.6 148,67.6 146.8,65.8 149.2,65.8 133.3,65.8 135.7,65.8 102,88.5 103,88.5 120,88.5 119,88.5 104.5,67.6 118,67.6 116.8,65.8 119.2,65.8 103.3,65.8 105.7,65.8 72,88.5 73,88.5 90,88.5 89,88.5 74.5,67.6 88,67.6 86.8,65.8 89.2,65.8 73.3,65.8 75.7,65.8 42,88.5 43,88.5 60,88.5 59,88.5 44.5,67.6 58,67.6 56.8,65.8 59.2,65.8 43.3,65.8 45.7,65.8 22,88.5 23,88.5 40,88.5 39,88.5 24.5,67.6 38,67.6 36.8,65.8 39.2,65.8 23.3,65.8 25.7,65.8 2,88.5 3,88.5 20,88.5 19,88.5 4.5,67.6 18,67.6 16.8,65.8 19.2,65.8 3.3,65.8 5.7,65.8 165.4,85.5 165.4,84.5 165.4,83.5 166.2,82.9 165.2,81.5 166.2,84 166.2,85 166.2,81.8 127,84 125.5,84 124.5,84 126,85 97,84 95.5,84 94.5,84 96,85 67,84 65.5,84 64.5,84 66,85 125,47 123.5,47 122.5,47 124,48 108,47 106.5,47 105.5,47 107,48 96,47 94.5,47 93.5,47 95,48 149,47 147.5,47 146.5,47 148,48 137,47 135.5,47 134.5,47 136,48 61.5,83.5 62.5,83.5 91.5,83.5 92.5,83.5 121.5,83.5 122.5,83.5 67,2 77,2 38.25,63.2 48.25,63.2
  pour Route2: 89.5,20.5 89.5,44 110,44 110,20.5
  pour Top (no thermals): 107.9,21.4 109.3,21.4 109.3,28.5 107.1,30.7 100.8,30.7 99.2,29.1 96.2,29.1 95,30.3 89.9,30.3 89.9,20.8 102.6,20.8 102.6,28.3 107.5,28.3 107.9,27.9
  pour Route2: 112.5,20.5 112.5,44 133,44 133,20.5
  pour Top (no thermals): 130.9,21.4 132.3,21.4 132.3,28.5 130.1,30.7 123.8,30.7 122.2,29.1 119.2,29.1 118,30.3 112.9,30.3 112.9,20.8 125.6,20.8 125.6,28.3 130.5,28.3 130.9,27.9
  pour Route2 (rank 2, no thermals): 131.5,91 150.5,91 150.5,64.25 131.5,64.25
  pour Top (rank 2, no thermals): 131.8,86.3 133.2,86.3 133.2,89 132.9,89.3 132.9,90.6 132.2,90.6 132.2,89.4 131.8,89
  pour Top (rank 2, no thermals): 148.8,86.3 150.2,86.3 150.2,89 149.9,89.3 149.9,90.6 149.2,90.6 149.2,89.4 148.8,89
  pour Top (no thermals): 136,67.9 133,67.9 133,64.4 136,64.4
  pour Top (no thermals): 146.5,64.4 149.5,64.4 149.5,67.9 146.5,67.9
  pour Route2 (rank 2, no thermals): 101.5,91 120.5,91 120.5,64.25 101.5,64.25
  pour Top (rank 2, no thermals): 101.8,86.3 103.2,86.3 103.2,89 102.9,89.3 102.9,90.6 102.2,90.6 102.2,89.4 101.8,89
  pour Top (rank 2, no thermals): 118.8,86.3 120.2,86.3 120.2,89 119.9,89.3 119.9,90.6 119.2,90.6 119.2,89.4 118.8,89
  pour Top (no thermals): 106,67.9 103,67.9 103,64.4 106,64.4
  pour Top (no thermals): 116.5,64.4 119.5,64.4 119.5,67.9 116.5,67.9
  pour Route2 (rank 2, no thermals): 71.5,91 90.5,91 90.5,64.25 71.5,64.25